# EAGLE design arm_brain_board (EAGLE 6.5.0)

## Sheet 1 of 2
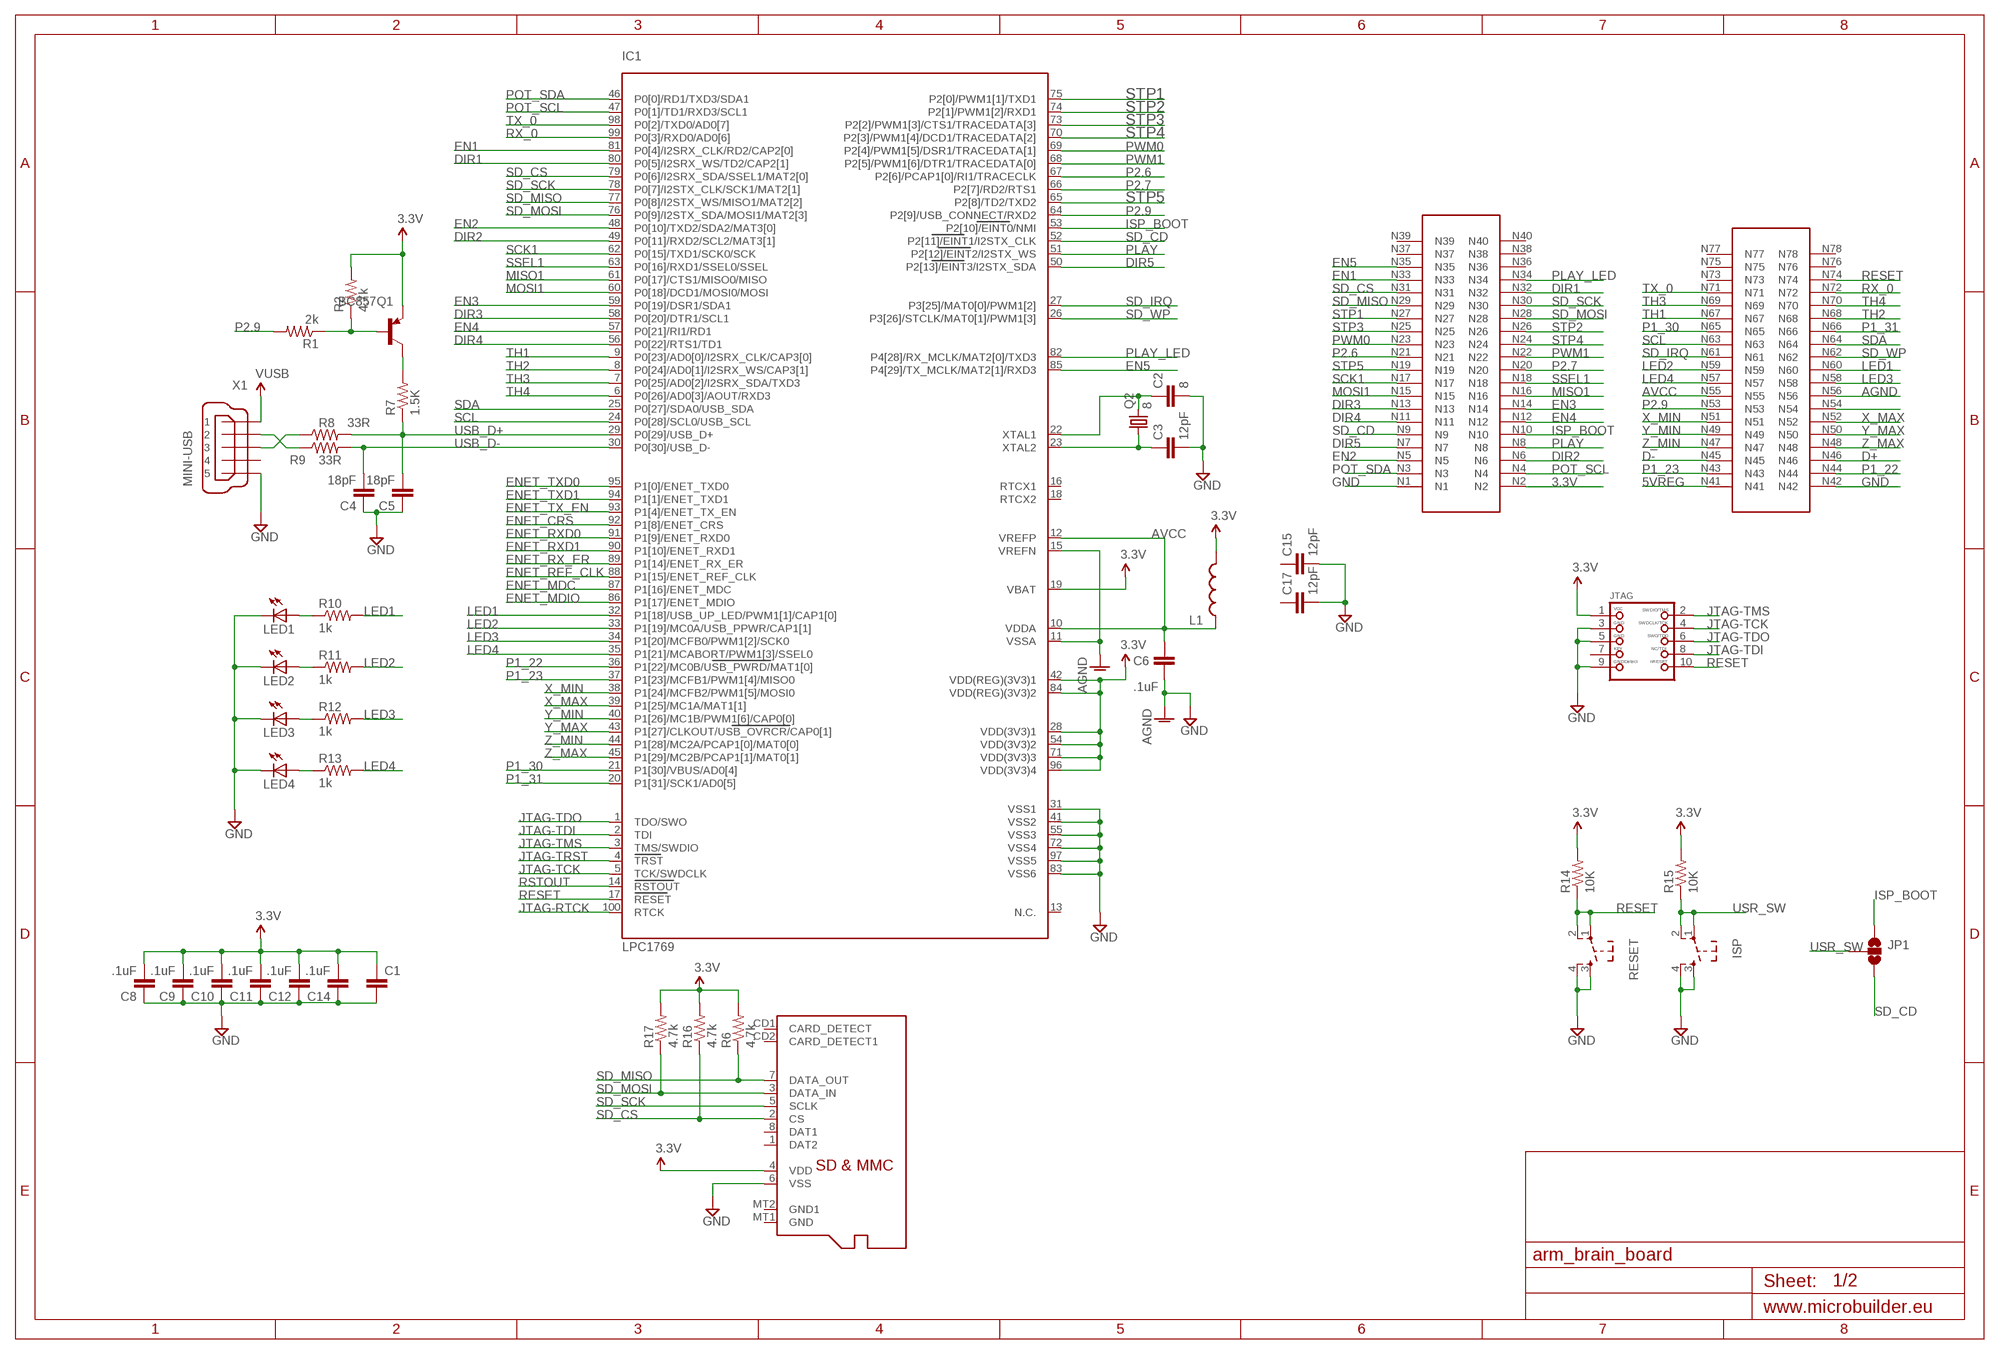
[diagram p0: schematic, sheet 1]

### Parts
C1  CAP0603-CAP  [0603-CAP]
C2  8  CAP0603-CAP  [0603-CAP]
C3  12pF  CAP0603-CAP  [0603-CAP]
C4  18pF  CAP0603-CAP  [0603-CAP]
C5  18pF  C-EUC0603  [C0603]
C6  .1uF  CAP0603-CAP  [0603-CAP]
C8  .1uF  CAP0603-CAP  [0603-CAP]
C9  .1uF  CAP0603-CAP  [0603-CAP]
C10  .1uF  CAP0603-CAP  [0603-CAP]
C11  .1uF  CAP0603-CAP  [0603-CAP]
C12  .1uF  CAP0603-CAP  [0603-CAP]
C14  .1uF  CAP0603-CAP  [0603-CAP]
C15  12pF  CAP0603-CAP  [0603-CAP]
C17  12pF  CAP0603-CAP  [0603-CAP]
IC1  LPC1769  LPC1768  [LQFP100]
ISP  SW_TACT_4P  [SW_TACT_SMALL]
JP1  SOLDERJUMPER_2WAYPASTE2&3  [SJ_3_PASTE2&3]
JTAG  JTAG-CORTEXM3  [2X05_1.27MM_SMT]
L1  INDUCTOR0603  [0603]
LED1  LEDCHIP-LED0603  [CHIP-LED0603]
LED2  LEDCHIP-LED0603  [CHIP-LED0603]
LED3  LEDCHIP-LED0603  [CHIP-LED0603]
LED4  LEDCHIP-LED0603  [CHIP-LED0603]
MICROSD  MICROSD  [MICROSD]
Q1  BC857  BC857BALT1SMD  [SOT23-BEC]
Q2  8  CRYSTALHC49S  [HC49/S]
R1  2k  RESISTOR0603-RES  [0603-RES]
R2  4.7k  RESISTOR0603-RES  [0603-RES]
R6  4.7k  RESISTOR0805-RES  [0805]
R7  1.5K  RESISTOR0603-RES  [0603-RES]
R8  33R  RESISTOR0805-RES  [0805]
R9  33R  RESISTOR0805-RES  [0805]
R10  1k  RESISTOR0603-RES  [0603-RES]
R11  1k  RESISTOR0603-RES  [0603-RES]
R12  1k  RESISTOR0603-RES  [0603-RES]
R13  1k  RESISTOR0603-RES  [0603-RES]
R14  10K  RESISTOR0603-RES  [0603-RES]
R15  10K  RESISTOR0603-RES  [0603-RES]
R16  4.7k  RESISTOR0805-RES  [0805]
R17  4.7k  RESISTOR0805-RES  [0805]
RESET  SW_TACT_4P  [SW_TACT_SMALL]
U$1  CPU_HEADER  [CPU_BOARD]
X1  MINI-USB  MINI-USB_SHIELD5P4-32005-400  [32005-400]

### Nets
3.3V: C1.1 C8.2 C9.2 C10.2 C11.2 C12.2 C14.2 IC1.19(VBAT) IC1.28(VDD(3V3)1) IC1.42(VDD(REG)(3V3)1) IC1.54(VDD(3V3)2) IC1.71(VDD(3V3)3) IC1.84(VDD(REG)(3V3)2) IC1.96(VDD(3V3)4) JTAG.1 L1.2 MICROSD.4(VDD) Q1.E R2.2 R6.2 R14.2 R15.2 R16.2 R17.2 U$1.N2 ; also sheet 2
5VREG: U$1.N41 ; also sheet 2
AGND: C6.2 IC1.11(VSSA) IC1.15(VREFN) U$1.N56 ; supply symbol labelled GND
AVCC: C6.1 IC1.10(VDDA) IC1.12(VREFP) L1.1 U$1.N55
D+: R8.1 U$1.N46 X1.3
D-: R9.1 U$1.N45 X1.2
DIR1: IC1.80(P0[5]/I2SRX_WS/TD2/CAP2[1]) U$1.N32
DIR2: IC1.49(P0[11]/RXD2/SCL2/MAT3[1]) U$1.N6
DIR3: IC1.58(P0[20]/DTR1/SCL1) U$1.N13
DIR4: IC1.56(P0[22]/RTS1/TD1) U$1.N11
DIR5: IC1.50(P2[13]/EINT3/I2STX_SDA) U$1.N7
EN1: IC1.81(P0[4]/I2SRX_CLK/RD2/CAP2[0]) U$1.N33
EN2: IC1.48(P0[10]/TXD2/SDA2/MAT3[0]) U$1.N5
EN3: IC1.59(P0[19]/DSR1/SDA1) U$1.N14
EN4: IC1.57(P0[21]/RI1/RD1) U$1.N12
EN5: IC1.85(P4[29]/TX_MCLK/MAT2[1]/RXD3) U$1.N35
ENET_CRS: IC1.92(P1[8]/ENET_CRS) ; also sheet 2
ENET_MDC: IC1.87(P1[16]/ENET_MDC) ; also sheet 2
ENET_MDIO: IC1.86(P1[17]/ENET_MDIO) ; also sheet 2
ENET_REF_CLK: IC1.88(P1[15]/ENET_REF_CLK) ; also sheet 2
ENET_RX_ER: IC1.89(P1[14]/ENET_RX_ER) ; also sheet 2
ENET_RXD0: IC1.91(P1[9]/ENET_RXD0) ; also sheet 2
ENET_RXD1: IC1.90(P1[10]/ENET_RXD1) ; also sheet 2
ENET_TX_EN: IC1.93(P1[4]/ENET_TX_EN) ; also sheet 2
ENET_TXD0: IC1.95(P1[0]/ENET_TXD0) ; also sheet 2
ENET_TXD1: IC1.94(P1[1]/ENET_TXD1) ; also sheet 2
GND: C1.2 C2.2 C3.2 C4.1 C5.1 C8.1 C9.1 C10.1 C11.1 C12.1 C14.1 C15.2 C17.2 IC1.31(VSS1) IC1.41(VSS2) IC1.55(VSS3) IC1.72(VSS4) IC1.83(VSS6) IC1.97(VSS5) ISP.3 ISP.4 JTAG.3 JTAG.5 JTAG.9 LED1.C LED2.C LED3.C LED4.C MICROSD.6(VSS) RESET.3 RESET.4 U$1.N1 U$1.N42 X1.5 ; also sheet 2
ISP_BOOT: IC1.53(P2[10]/EINT0/NMI) JP1.1 U$1.N10
JTAG-RTCK: IC1.100(RTCK)
JTAG-TCK: IC1.5(TCK/SWDCLK) JTAG.4
JTAG-TDI: IC1.2(TDI) JTAG.8
JTAG-TDO: IC1.1(TDO/SWO) JTAG.6
JTAG-TMS: IC1.3(TMS/SWDIO) JTAG.2
JTAG-TRST: IC1.4(TRST)
LED1: IC1.32(P1[18]/USB_UP_LED/PWM1[1]/CAP1[0]) R10.2 U$1.N60
LED2: IC1.33(P1[19]/MC0A/USB_PPWR/CAP1[1]) R11.2 U$1.N59
LED3: IC1.34(P1[20]/MCFB0/PWM1[2]/SCK0) R12.2 U$1.N58
LED4: IC1.35(P1[21]/MCABORT/PWM1[3]/SSEL0) R13.2 U$1.N57
MISO1: IC1.61(P0[17]/CTS1/MISO0/MISO) U$1.N16
MOSI1: IC1.60(P0[18]/DCD1/MOSI0/MOSI) U$1.N15
N$1: C2.1 IC1.22(XTAL1) Q2.2
N$2: C3.1 IC1.23(XTAL2) Q2.1
N$3: Q1.B R1.1 R2.1
N$12: U$1.N54
N$51: Q1.C R7.2
N$84: LED4.A R13.1
N$85: LED3.A R12.1
N$86: LED2.A R11.1
N$87: LED1.A R10.1
P1_22: IC1.36(P1[22]/MC0B/USB_PWRD/MAT1[0]) U$1.N44
P1_23: IC1.37(P1[23]/MCFB1/PWM1[4]/MISO0) U$1.N43
P1_30: IC1.21(P1[30]/VBUS/AD0[4]) U$1.N65
P1_31: IC1.20(P1[31]/SCK1/AD0[5]) U$1.N66
P2.6: IC1.67(P2[6]/PCAP1[0]/RI1/TRACECLK) U$1.N21
P2.7: IC1.66(P2[7]/RD2/RTS1) U$1.N20
P2.9: IC1.64(P2[9]/USB_CONNECT/RXD2) R1.2 U$1.N53
PLAY: IC1.51(P2[12]/EINT2/I2STX_WS) U$1.N8
PLAY_LED: IC1.82(P4[28]/RX_MCLK/MAT2[0]/TXD3) U$1.N34
POT_SCL: IC1.47(P0[1]/TD1/RXD3/SCL1) U$1.N4
POT_SDA: IC1.46(P0[0]/RD1/TXD3/SDA1) U$1.N3
PWM0: IC1.69(P2[4]/PWM1[5]/DSR1/TRACEDATA[1]) U$1.N23
PWM1: IC1.68(P2[5]/PWM1[6]/DTR1/TRACEDATA[0]) U$1.N22
RESET: IC1.17(RESET) JTAG.10 R14.1 RESET.1 RESET.2 U$1.N74
RSTOUT: IC1.14(RSTOUT) ; also sheet 2
RX_0: IC1.99(P0[3]/RXD0/AD0[6]) U$1.N72
SCK1: IC1.62(P0[15]/TXD1/SCK0/SCK) U$1.N17
SCL: IC1.24(P0[28]/SCL0/USB_SCL) U$1.N63
SD_CD: IC1.52(P2[11]/EINT1/I2STX_CLK) JP1.3 U$1.N9
SD_CS: IC1.79(P0[6]/I2SRX_SDA/SSEL1/MAT2[0]) MICROSD.2(CS) R16.1 U$1.N31
SD_IRQ: IC1.27(P3[25]/MAT0[0]/PWM1[2]) U$1.N61
SD_MISO: IC1.77(P0[8]/I2STX_WS/MISO1/MAT2[2]) MICROSD.7(DATA_OUT) R6.1 U$1.N29
SD_MOSI: IC1.76(P0[9]/I2STX_SDA/MOSI1/MAT2[3]) MICROSD.3(DATA_IN) R17.1 U$1.N28
SD_SCK: IC1.78(P0[7]/I2STX_CLK/SCK1/MAT2[1]) MICROSD.5(SCLK) U$1.N30
SD_WP: IC1.26(P3[26]/STCLK/MAT0[1]/PWM1[3]) U$1.N62
SDA: IC1.25(P0[27]/SDA0/USB_SDA) U$1.N64
SSEL1: IC1.63(P0[16]/RXD1/SSEL0/SSEL) U$1.N18
STP1: IC1.75(P2[0]/PWM1[1]/TXD1) U$1.N27
STP2: IC1.74(P2[1]/PWM1[2]/RXD1) U$1.N26
STP3: IC1.73(P2[2]/PWM1[3]/CTS1/TRACEDATA[3]) U$1.N25
STP4: IC1.70(P2[3]/PWM1[4]/DCD1/TRACEDATA[2]) U$1.N24
STP5: IC1.65(P2[8]/TD2/TXD2) U$1.N19
TH1: IC1.9(P0[23]/AD0[0]/I2SRX_CLK/CAP3[0]) U$1.N67
TH2: IC1.8(P0[24]/AD0[1]/I2SRX_WS/CAP3[1]) U$1.N68
TH3: IC1.7(P0[25]/AD0[2]/I2SRX_SDA/TXD3) U$1.N69
TH4: IC1.6(P0[26]/AD0[3]/AOUT/RXD3) U$1.N70
TX_0: IC1.98(P0[2]/TXD0/AD0[7]) U$1.N71
USB_D+: C5.2 IC1.29(P0[29]/USB_D+) R7.1 R8.2
USB_D-: C4.2 IC1.30(P0[30]/USB_D-) R9.2
USR_SW: ISP.1 ISP.2 JP1.2 R15.1
VUSB: X1.1 ; also sheet 2
X_MAX: IC1.39(P1[25]/MC1A/MAT1[1]) U$1.N52
X_MIN: IC1.38(P1[24]/MCFB2/PWM1[5]/MOSI0) U$1.N51
Y_MAX: IC1.43(P1[27]/CLKOUT/USB_OVRCR/CAP0[1]) U$1.N50
Y_MIN: IC1.40(P1[26]/MC1B/PWM1[6]/CAP0[0]) U$1.N49
Z_MAX: IC1.45(P1[29]/MC2B/PCAP1[1]/MAT0[1]) U$1.N48
Z_MIN: IC1.44(P1[28]/MC2A/PCAP1[0]/MAT0[0]) U$1.N47
Unconnected: C15.1 C17.1 IC1.13(N.C.) IC1.16(RTCX1) IC1.18(RTCX2) JTAG.7 MICROSD.1(DAT2) MICROSD.8(DAT1) MICROSD.CD1(CARD_DETECT) MICROSD.CD2(CARD_DETECT1) MICROSD.MT1(GND) MICROSD.MT2(GND1) U$1.N36 U$1.N37 U$1.N38 U$1.N39 U$1.N40 U$1.N73 U$1.N75 U$1.N76 U$1.N77 U$1.N78 X1.4 X1.M1(S1) X1.M2(S2) X1.M3(S3) X1.M4(S4)

## Sheet 2 of 2
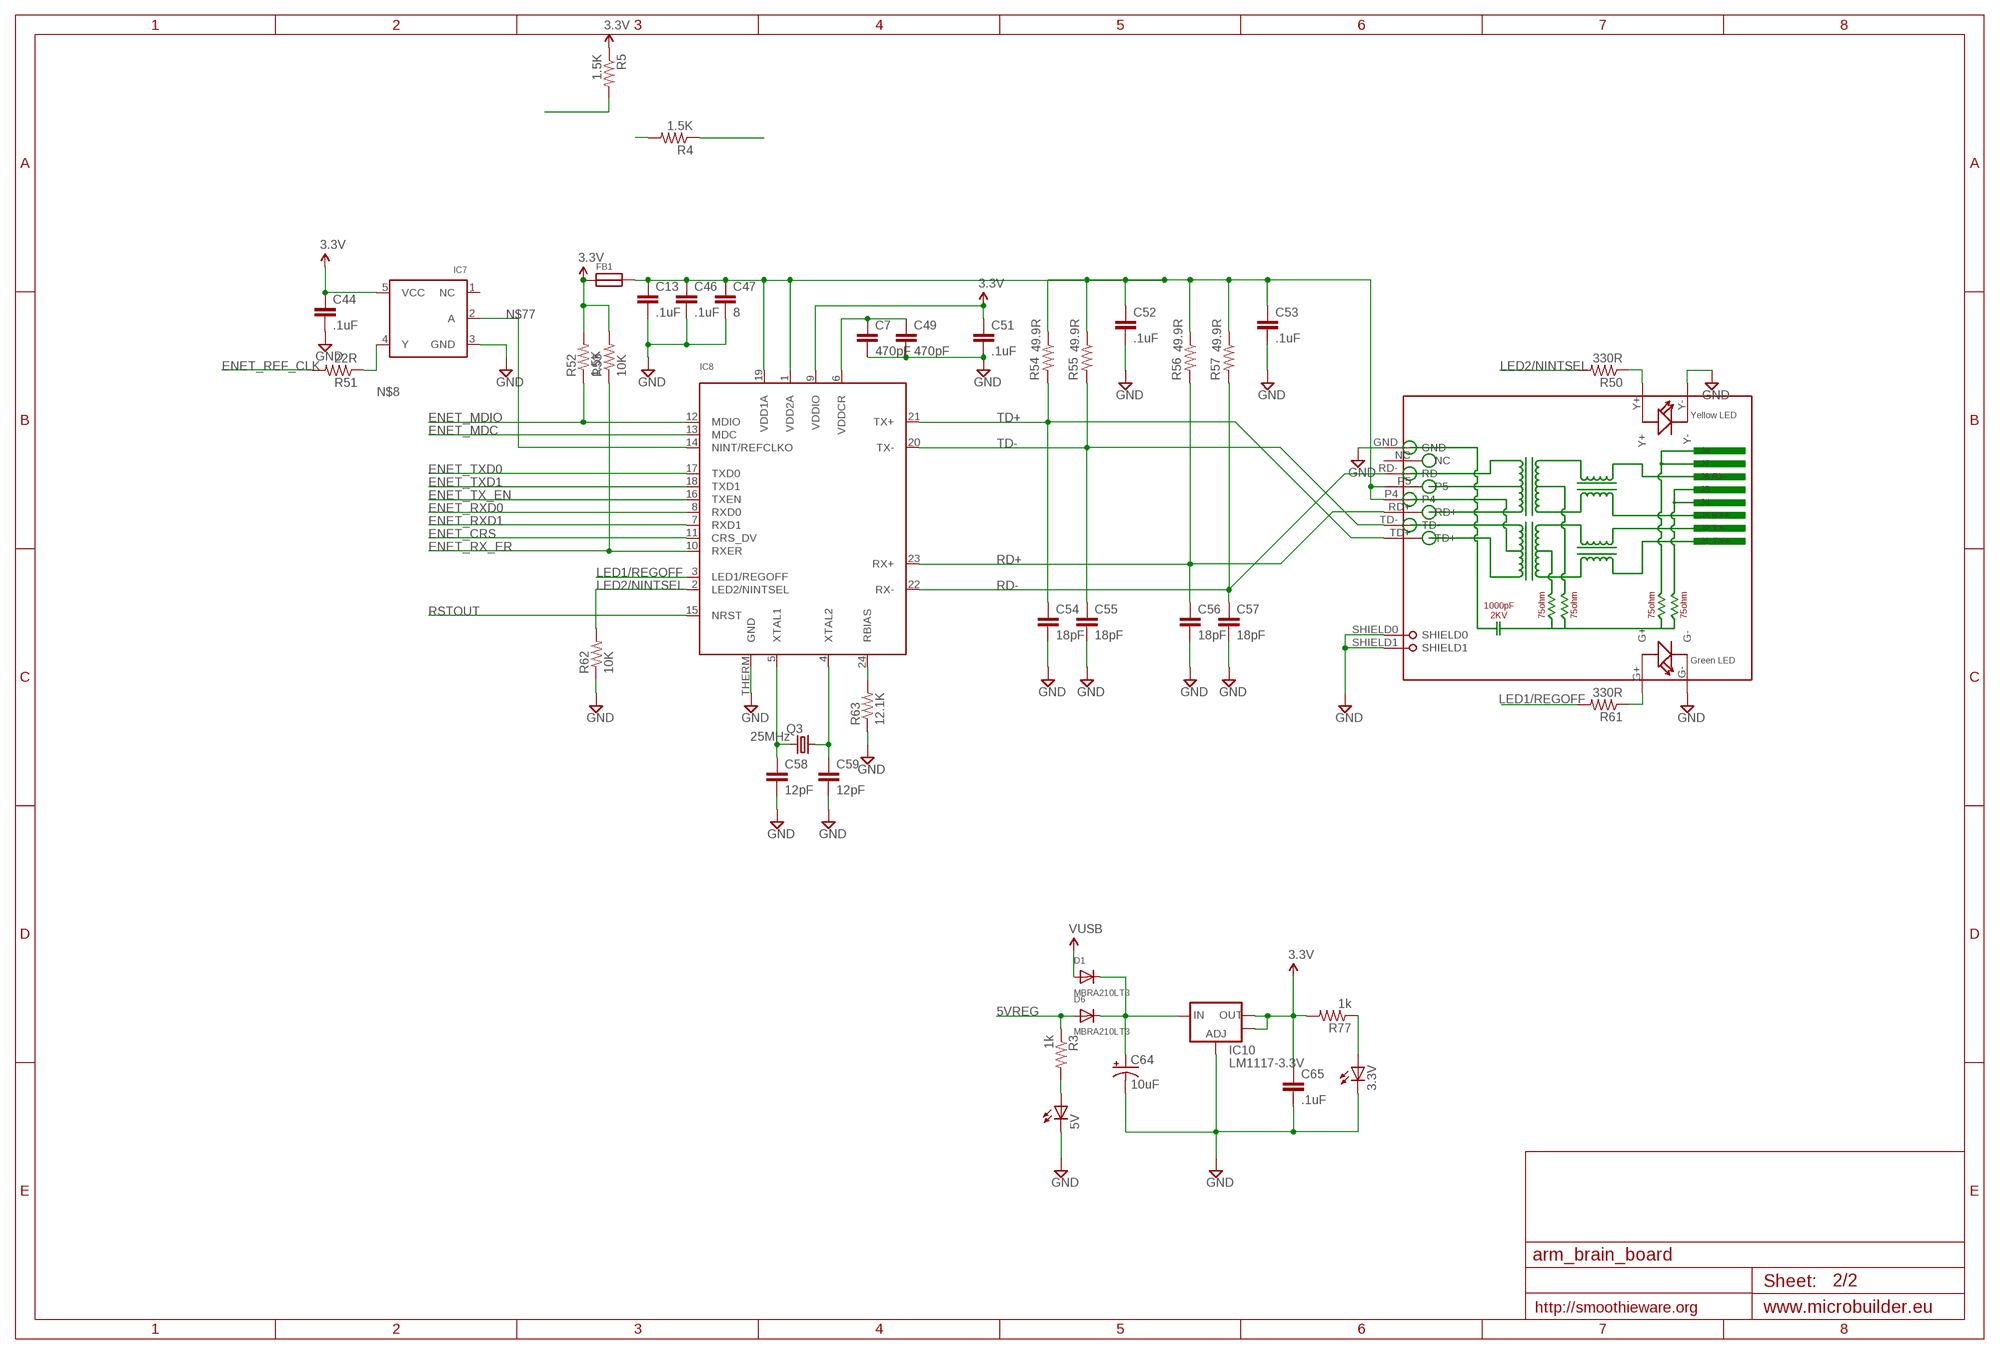
[diagram p1: schematic, sheet 2]

### Parts
3.3V  LEDCHIP-LED0603  [CHIP-LED0603]
5V  LEDCHIP-LED0603  [CHIP-LED0603]
C7  470pF  CAP0603-CAP  [0603-CAP]
C13  .1uF  CAP0603-CAP  [0603-CAP]
C44  .1uF  CAP0603-CAP  [0603-CAP]
C46  .1uF  CAP0603-CAP  [0603-CAP]
C47  8  CAP0603-CAP  [0603-CAP]
C49  470pF  CAP0603-CAP  [0603-CAP]
C51  .1uF  CAP0603-CAP  [0603-CAP]
C52  .1uF  CAP0603-CAP  [0603-CAP]
C53  .1uF  CAP0603-CAP  [0603-CAP]
C54  18pF  CAP0805  [0805]
C55  18pF  CAP0603-CAP  [0603-CAP]
C56  18pF  CAP0603-CAP  [0603-CAP]
C57  18pF  CAP0805  [0805]
C58  12pF  CAP0603-CAP  [0603-CAP]
C59  12pF  CAP0603-CAP  [0603-CAP]
C64  10uF  CAP_POL1206  [EIA3216]
C65  .1uF  CAP0805  [0805]
D1  MBRA210LT3  DIODESOD-123  [SOD-123]
D6  MBRA210LT3  DIODESOD-123  [SOD-123]
FB1  FERRITE  [0603]
IC7  74LVC1G04  [SOT23-5]
IC8  LAN8720  [QFN24_4MM]
IC10  LM1117-3.3V  V_REG_LM1117SOT223  [SOT223]
Q3  25MHz  CRYSTALHC49S  [HC49/S]
R3  1k  RESISTOR0603-RES  [0603-RES]
R4  1.5K  RESISTOR0603-RES  [0603-RES]
R5  1.5K  RESISTOR0603-RES  [0603-RES]
R50  330R  R-US_R0603  [R0603]
R51  22R  RESISTOR0603-RES  [0603-RES]
R52  1.5K  RESISTOR0603-RES  [0603-RES]
R53  10K  RESISTOR0603-RES  [0603-RES]
R54  49.9R  RESISTOR0603-RES  [0603-RES]
R55  49.9R  RESISTOR0805-RES  [0805]
R56  49.9R  RESISTOR0805-RES  [0805]
R57  49.9R  RESISTOR0603-RES  [0603-RES]
R61  330R  R-US_R0603  [R0603]
R62  10K  RESISTOR0603-RES  [0603-RES]
R63  12.1K  RESISTOR0603-RES  [0603-RES]
R77  1k  RESISTOR0603-RES  [0603-RES]
RJ1  HR911105A  [HR911105A]

### Nets
3.3V: C44.1 C51.1 C65.1 FB1.1 IC7.5(VCC) IC8.9(VDDIO) IC10.2(OUT) IC10.4(OUT) R5.1 R52.2 R53.2 R77.2 ; also sheet 1
5VREG: D6.A R3.1 ; also sheet 1
ENET_CRS: IC8.11(CRS_DV) ; also sheet 1
ENET_MDC: IC8.13(MDC) ; also sheet 1
ENET_MDIO: IC8.12(MDIO) R52.1 ; also sheet 1
ENET_REF_CLK: R51.2 ; also sheet 1
ENET_RX_ER: IC8.10(RXER) R53.1 ; also sheet 1
ENET_RXD0: IC8.8(RXD0) ; also sheet 1
ENET_RXD1: IC8.7(RXD1) ; also sheet 1
ENET_TX_EN: IC8.16(TXEN) ; also sheet 1
ENET_TXD0: IC8.17(TXD0) ; also sheet 1
ENET_TXD1: IC8.18(TXD1) ; also sheet 1
GND: 3.3V.C 5V.C C7.2 C13.2 C44.2 C46.2 C47.2 C49.2 C51.2 C52.2 C53.2 C54.2 C55.2 C56.2 C57.2 C58.2 C59.2 C64.C(-) C65.2 IC7.3(GND) IC8.THERM(GND) IC10.1(ADJ) R62.1 R63.1 RJ1.G- RJ1.GND RJ1.SHIELD0 RJ1.SHIELD1 RJ1.Y- ; also sheet 1
LED1/REGOFF: IC8.3(LED1/REGOFF) R61.2
LED2/NINTSEL: IC8.2(LED2/NINTSEL) R50.2 R62.2
N$4: C64.A(+) D1.C D6.C IC10.3(IN)
N$5: R50.1 RJ1.Y+
N$6: R61.1 RJ1.G+
N$8: IC7.4(Y) R5.2 R51.1
N$9: R4.2
N$10: 5V.A R3.2
N$16: C13.1 C46.1 C47.1 C52.1 C53.1 FB1.2 IC8.1(VDD2A) IC8.19(VDD1A) R54.1 R55.1 R56.1 R57.1 RJ1.P4 RJ1.P5
N$67: C59.1 IC8.4(XTAL2) Q3.1
N$68: C58.1 IC8.5(XTAL1) Q3.2
N$69: IC8.24(RBIAS) R63.2
N$77: IC7.2(A) IC8.14(NINT/REFCLKO) R4.1
N$80: 3.3V.A R77.1
N$82: C7.1 C49.1 IC8.6(VDDCR)
RD+: C56.1 IC8.23(RX+) R56.2 RJ1.RD+
RD-: C57.1 IC8.22(RX-) R57.2 RJ1.RD-
RSTOUT: IC8.15(NRST) ; also sheet 1
TD+: C54.1 IC8.21(TX+) R54.2 RJ1.TD+
TD-: C55.1 IC8.20(TX-) R55.2 RJ1.TD-
VUSB: D1.A ; also sheet 1
Unconnected: IC7.1(NC) RJ1.NC

### Notes on the sheet
- http://smoothieware.org

## Library data of the parts
3.3V 5V LED1-LED4 = adafruit:LED: LED OSRAM: - CHIPLED LG R971, LG N971, LY N971, LG Q971, LY Q971, LO R971, LY R971 LH N974, LH R974 LS Q976, LO Q976, LY Q976 LO Q996 - Hyper CHIPLED LW Q18S LB Q993, LB Q99A, LB R99A - SideLED LS A670, LO A670, LY A670, LG A670, LP A670 LB A673, LV A673, LT A673, LW A673 LH A674 LY A675 LS A676, LA A676, LO A676, LY A676, LW A676 LS A679, LY A679, LG A679 - Hyper Micro SIDELED® LS Y876, LA Y876, LO Y876, LY Y876 LT Y87S - SmartLED LW L88C, LW L88S LB L89C, LB L89S, LG L890 LS L89K, LO L89K, LY L89K LS L896, LA L896, LO L896, LY L896 - TOPLED LS T670, LO T670, LY T670, LG T670, LP T670 LSG T670, LSP T670, LSY T670, LOP T670, LYG T670 LG T671, LOG T671, LSG T671 LB T673, LV T673, LT T673, LW T673 LH T674 LS T676, LA T676, LO T676, LY T676, LB T676, LH T676, LSB T676, LW T676 LB T67C, LV T67C, LT T67C, LS T67K, LO T67K, LY T67K, LW E67C LS E67B, LA E67B, LO E67B, LY E67B, LB E67C, LV E67C, LT E67C LW T67C LS T679, LY T679, LG T679 LS T770, LO T770, LY T770, LG T770, LP T770 LB T773, LV T773, LT T773, LW T773 LH T774 LS E675, LA E675, LY E675, LS T675 LS T776, LA T776, LO T776, LY T776, LB T776 LHGB T686 LT T68C, LB T68C - Hyper Mini TOPLED® LB M676 - Mini TOPLED Santana® LG M470 LS M47K, LO M47K, LY M47K Source: http://www.osram.convergy.de/
C1-C4 C6-C15 C17 C44 C46 C47 C49 C51-C59 C65 = SparkFun:CAP: Capacitor Standard 0603 ceramic capacitor, and 0.1" leaded capacitor.
C5 = rcl:C-EU: CAPACITOR, European symbol
C64 = SparkFun:CAP_POL: Capacitor Polarized These are standard SMD and PTH capacitors. Normally 10uF, 47uF, and 100uF in electrolytic and tantalum varieties. Always verify the external diameter of the through hole cap, it varies with capacity, voltage, and manufacturer. The EIA devices should be standard.
D1 D6 = adafruit:DIODE: Diode SMADIODE - SMA Surface Mount Package 20V 1A Schottky Diode Digikey: 641-1014-6-ND DO-1N4148 - Through Hole Small Current Diode SOD-123 20V 1 A (.5mV Vf) Schottky Diode - Digikey: MBRX120TPMSCT-ND SOD-323 10V 570mA (.38mV Vf, 3ns) Schottky Diode - Digikey: ZLLS410CT-ND SOD-523 30V 30mA Schottky Diode (RB751S-40TE61) - Digikey: RB751S-40TE61CT-ND SOT23-R/W - SOT23 Package (R = Solder Paste/Reflow Ovens, W = Hand-Soldering) BAT54Film 40V 300mA - Digikey: 497-7162-1-ND
FB1 = microbuilder:FERRITE: Ferrite Bead 0603 MMZ1608B121C - 120 Ohm, 600mA Ferrite Chip - Digikey: 445-2164-1-ND BK1608HW121-T - 120 Ohm, 600mA Ferrite Chip - Digikey: 587-1876-2-ND
IC1 = microbuilder:LPC1768: LPC1768 100 MHz 32-bit ARM Cortex-M3 based microcontroller featuring a high level of integration and low power consumption. 512 kB Flash, 64 kB SRAM, USB Device/Host/OTG, Ethernet, CAN, I2S, 10-bit DAC Digikey: 568-4796-ND
IC7 = microbuilder:74LVC1G04: 74LVC1G04 - Single Inverter Gate SOT23-5 SN74LVC1G04DBVR - Digikey: 296-11599-1-ND
IC8 = microbuilder:LAN8720: LAN8720A 10/100 Ethernet PHY Mouser: 886-LAN8720AI-CP
IC10 = SparkFun:V_REG_LM1117: Voltage Regulator LM1117 Standard adjustable voltage regulator but in SMD form. Spark Fun Electronics SKU : COM-00595
ISP RESET = dp_devices:SW_TACT_4P
JP1 = SparkFun:SOLDERJUMPER_2WAY: Solder Jumper 2 way solder jumper
JTAG = microbuilder:JTAG-CORTEXM3: Serial Wire (SW-DP) Connector This standard 0.05" 10-pin connector is for use with the Cortex M0/M3's native SWD (serial wire debugger) interface (SW-DP). Some boards support a 20-pin combined JTAG+SWD connector (SWJ-DP), such as the LPC1700 family, but many smaller devices only work with SWD which typically use the smaller 10-pin SW-DP connecter (the LPC1300 family, for example, only supports SWD). 2x05 1.27mm/0.05" Connector: This is the standard SMT connector defined by ARM for all Cortex devices, and should be used in most situations and for forward-compatibility since any new devices coming to market will likely use this connector. MOLEX 10 Pin 0.1" Connector: This 0.1" 10 pin connector has the same pin layout as the standard 0.05" connector, but is easier to work with if you are using standard jumper wires or custom cables to connect your SWD hardware. MOLEX 20 Pin 0.1" Connector: This 0.1" 20 pin connector is the same model used for ARM7/ARM9 JTAG debuggers, but is connected to match the pins on the Segger J-Link for ARM (which supports both JTAG and SWD debugging). See the following document from ARM for more information on Cortex M3 Debug Connectors: http://infocenter.arm.com/help/topic/com.arm.doc.faqs/attached/13634/cortex_debug_connectors.pdf And the following page for an overview with images of the different connector types: http://www.keil.com/peripherals/coresight/connectors.asp
L1 = SparkFun:INDUCTOR: Inductors Basic Inductor/Choke - 0603 and 1206. Footprints are not proven and vary greatly between part numbers.
MICROSD = adafruit:MICROSD: Micro-SD / Transflash card holder with SPI pinout For the 3M # 2908-05WB-MG and/or 4UCON #19656 push-push type
Q1 = transistor-pnp:BC857*: PNP Transistror
Q2 Q3 = adafruit:CRYSTAL: CRYSTAL; OC_FARNELL: 1667008; OC_NEWARK: unknown
R1-R17 R51-R57 R62 R63 R77 = SparkFun:RESISTOR: Resistor Basic schematic elements and footprints for 0603, 1206, and PTH resistors.
R50 R61 = resistor:R-US_: RESISTOR, American symbol
RJ1 = Itead_BP_110825.lbr:HR911105A: SOC006
U$1 = custom_parts:CPU_HEADER
X1 = con-cypressindustries:MINI-USB_SHIELD5P4-: MINI USB-B R/A W/O POST 5 pol. Source: www.cypressindustries.com; OC_FARNELL: unknown; OC_NEWARK: unknown

## Board
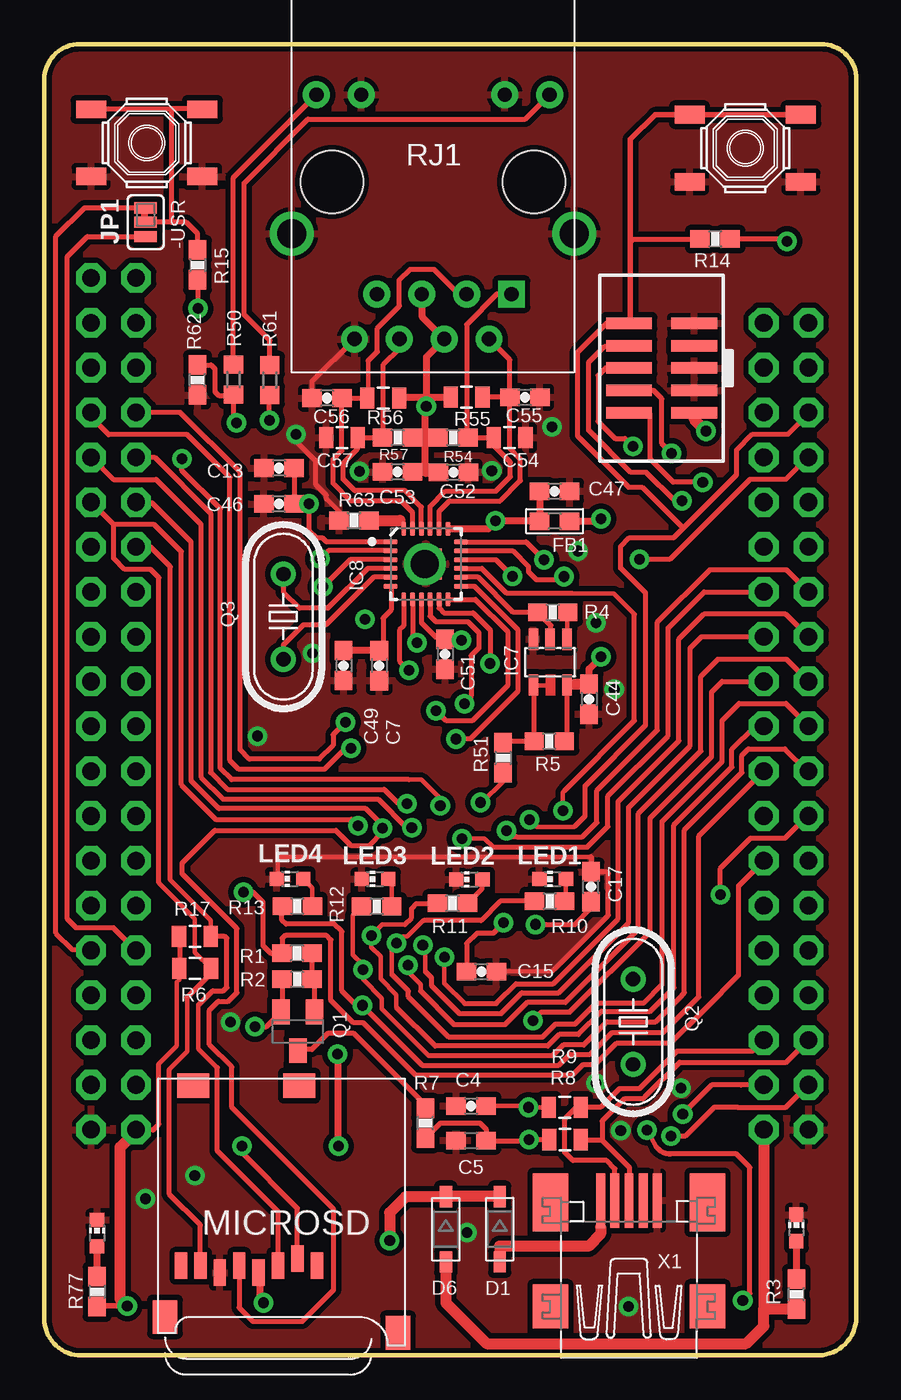
[diagram p2: board, top side]
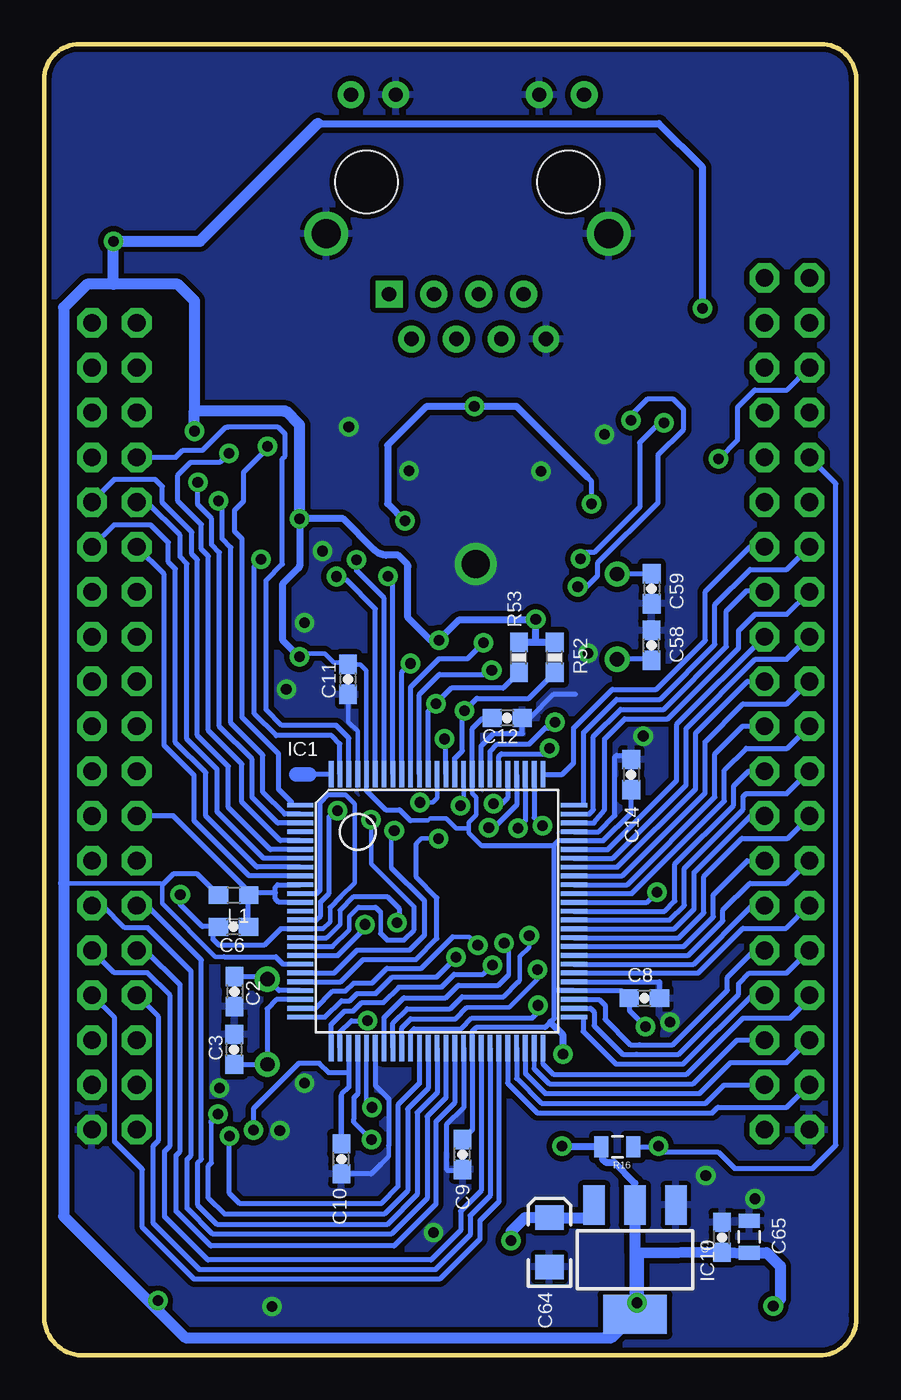
[diagram p3: board, bottom side, seen from below]

Size 46.01 x 74.3 mm. Coordinates in mm from the lower left corner, seen from the top.
Outline: 43.91,0 arc90 46.01,2.3 46.01,72.3 arc90 44.01,74.3 2.01,74.3 arc90 0.01,72.3 0.01,2.3 arc90 1.91,0 43.91,0
Copper layers (1*16): Top 0.035mm / dielectric 1.5mm / Bottom 0.035mm
Design rules "SparkFun": minimum track width 8mil, minimum drill 20mil, track to track 8mil, track to pad 8mil, pad to pad 8mil, via to via 8mil, smd to smd 8mil, copper to edge 10mil, drill to drill 8mil, minimum pad ring 12mil, minimum via ring 10mil, stop-mask expansion 4mil, vias tented up to drill 25mil, thermal gap 10mil

### Footprints (pad centres in the part's own frame; a part is rotated, then mirrored left to right if it is on the bottom)
CHIP-LED0603 = smd 0.8 x 0.8: A 0,-0.75; C 0,0.75
0603-CAP = smd 1.1 x 1: 1 -0.85,0; 2 0.85,0
C0603 = smd 1.1 x 1: 1 -0.85,0; 2 0.85,0
0805 = smd 0.8 x 1.2: 1 -0.9,0; 2 0.9,0
EIA3216 = smd 1.4 x 1.6: A 1.4,0; C -1.4,0
SOD-123 = smd 1.2 x 0.7: A 1.85,0; C -1.85,0
0603 = smd 1.1 x 1: 1 -0.85,0; 2 0.85,0
LQFP100 = smd 0.27 x 1.5: 1 -6,-7.75; 2 -5.5,-7.75; 3 -5,-7.75; 4 -4.5,-7.75; 5 -4,-7.75; 6 -3.5,-7.75; 7 -3,-7.75; 8 -2.5,-7.75; 9 -2,-7.75; 10 -1.5,-7.75; 11 -1,-7.75; 12 -0.5,-7.75; 13 0,-7.75; 14 0.5,-7.75; 15 1,-7.75; 16 1.5,-7.75; 17 2,-7.75; 18 2.5,-7.75; 19 3,-7.75; 20 3.5,-7.75; 21 4,-7.75; 22 4.5,-7.75; 23 5,-7.75; 24 5.5,-7.75; 25 6,-7.75; 51 6,7.75; 52 5.5,7.75; 53 5,7.75; 54 4.5,7.75; 55 4,7.75; 56 3.5,7.75; 57 3,7.75; 58 2.5,7.75; 59 2,7.75; 60 1.5,7.75; 61 1,7.75; 62 0.5,7.75; 63 0,7.75; 64 -0.5,7.75; 65 -1,7.75; 66 -1.5,7.75; 67 -2,7.75; 68 -2.5,7.75; 69 -3,7.75; 70 -3.5,7.75; 71 -4,7.75; 72 -4.5,7.75; 73 -5,7.75; 74 -5.5,7.75; 75 -6,7.75 | smd 1.5 x 0.27: 26 7.75,-6; 27 7.75,-5.5; 28 7.75,-5; 29 7.75,-4.5; 30 7.75,-4; 31 7.75,-3.5; 32 7.75,-3; 33 7.75,-2.5; 34 7.75,-2; 35 7.75,-1.5; 36 7.75,-1; 37 7.75,-0.5; 38 7.75,0; 39 7.75,0.5; 40 7.75,1; 41 7.75,1.5; 42 7.75,2; 43 7.75,2.5; 44 7.75,3; 45 7.75,3.5; 46 7.75,4; 47 7.75,4.5; 48 7.75,5; 49 7.75,5.5; 50 7.75,6; 76 -7.75,6; 77 -7.75,5.5; 78 -7.75,5; 79 -7.75,4.5; 80 -7.75,4; 81 -7.75,3.5; 82 -7.75,3; 83 -7.75,2.5; 84 -7.75,2; 85 -7.75,1.5; 86 -7.75,1; 87 -7.75,0.5; 88 -7.75,0; 89 -7.75,-0.5; 90 -7.75,-1; 91 -7.75,-1.5; 92 -7.75,-2; 93 -7.75,-2.5; 94 -7.75,-3; 95 -7.75,-3.5; 96 -7.75,-4; 97 -7.75,-4.5; 98 -7.75,-5; 99 -7.75,-5.5; 100 -7.75,-6
SOT23-5 = smd 0.55 x 1.2: 1 -0.95,-1.3; 2 0,-1.3; 3 0.95,-1.3; 4 0.95,1.3; 5 -0.95,1.3
QFN24_4MM = smd 0.8 x 0.28: 1 -2,1.25; 2 -2,0.75; 3 -2,0.25; 4 -2,-0.25; 5 -2,-0.75; 6 -2,-1.25; 13 2,-1.25; 14 2,-0.75; 15 2,-0.25; 16 2,0.25; 17 2,0.75; 18 2,1.25 | smd 0.28 x 0.8: 7 -1.25,-2; 8 -0.75,-2; 9 -0.25,-2; 10 0.25,-2; 11 0.75,-2; 12 1.25,-2; 19 1.25,2; 20 0.75,2; 21 0.25,2; 22 -0.25,2; 23 -0.75,2; 24 -1.25,2 | smd 1.778 x 1.778: THERM 0,0
SOT223 = smd 1.219 x 2.235: 1 -2.311,-3.099; 2 0,-3.099; 3 2.311,-3.099 | smd 3.6 x 2.2: 4 0,3.099
SW_TACT_SMALL = smd 1.7 x 1: 1 -3.15,1.9; 2 3.15,1.9; 3 -3.15,-1.9; 4 3.15,-1.9
SJ_3_PASTE2&3 = smd 0.635 x 1.27: 1 -0.813,0; 2 0,0; 3 0.813,0
2X05_1.27MM_SMT = smd 0.65 x 2.6: 1 -2.54,-1.85; 2 -2.54,1.85; 3 -1.27,-1.85; 4 -1.27,1.85; 5 0,-1.85; 6 0,1.85; 7 1.27,-1.85; 8 1.27,1.85; 9 2.54,-1.85; 10 2.54,1.85
MICROSD = smd 0.7 x 1.5: 1 9,-10.64; 2 7.9,-10.24; 3 6.8,-10.64; 4 5.7,-11.04; 5 4.6,-10.64; 6 3.5,-11.04; 7 2.4,-10.64; 8 1.3,-10.64 | smd 1.8 x 1.4: CD1 2,-0.44; CD2 8,-0.44 | smd 1.4 x 1.9: MT1 0.4,-13.54; MT2 13.6,-14.44
SOT23-BEC = smd 1 x 1.4: B -0.95,-1.1; C 0,1.1; E 0.95,-1.1
HC49/S = drill 0.813: 1 -2.413,0; 2 2.413,0
0603-RES = smd 1.1 x 1: 1 -0.85,0; 2 0.85,0
R0603 = smd 1 x 1.1: 1 -0.85,0; 2 0.85,0
HR911105A = drill 0.813 pad 1.524: G+ 4.953,-6.604; G- 4.953,-4.064; GND -8.89,4.445; NC -6.35,3.175; P4 -8.89,-0.635; P5 -6.35,0.635; RD+ -6.35,-1.905; RD- -8.89,1.905; TD- -8.89,-3.175; Y+ 4.953,6.604; Y- 4.953,4.064 | drill 1.651 pad 2.159: SHIELD0 -2.921,8.001; SHIELD1 -2.921,-8.001 | drill 0.813 pad 1.524 square: TD+ -6.35,-4.445 | hole 3.556: 0,-5.715; 0,5.715
CPU_BOARD = drill 1 pad 1.676 octagon: N1 0,0; N2 2.54,0; N3 0,2.54; N4 2.54,2.54; N5 0,5.08; N6 2.54,5.08; N7 0,7.62; N8 2.54,7.62; N9 0,10.16; N10 2.54,10.16; N11 0,12.7; N12 2.54,12.7; N13 0,15.24; N14 2.54,15.24; N15 0,17.78; N16 2.54,17.78; N17 0,20.32; N18 2.54,20.32; N19 0,22.86; N20 2.54,22.86; N21 0,25.4; N22 2.54,25.4; N23 0,27.94; N24 2.54,27.94; N25 0,30.48; N26 2.54,30.48; N27 0,33.02; N28 2.54,33.02; N29 0,35.56; N30 2.54,35.56; N31 0,38.1; N32 2.54,38.1; N33 0,40.64; N34 2.54,40.64; N35 0,43.18; N36 2.54,43.18; N37 0,45.72; N38 2.54,45.72; N39 0,48.26; N40 2.54,48.26; N41 38.1,0; N42 40.64,0; N43 38.1,2.54; N44 40.64,2.54; N45 38.1,5.08; N46 40.64,5.08; N47 38.1,7.62; N48 40.64,7.62; N49 38.1,10.16; N50 40.64,10.16; N51 38.1,12.7; N52 40.64,12.7; N53 38.1,15.24; N54 40.64,15.24; N55 38.1,17.78; N56 40.64,17.78; N57 38.1,20.32; N58 40.64,20.32; N59 38.1,22.86; N60 40.64,22.86; N61 38.1,25.4; N62 40.64,25.4; N63 38.1,27.94; N64 40.64,27.94; N65 38.1,30.48; N66 40.64,30.48; N67 38.1,33.02; N68 40.64,33.02; N69 38.1,35.56; N70 40.64,35.56; N71 38.1,38.1; N72 40.64,38.1; N73 38.1,40.64; N74 40.64,40.64; N75 38.1,43.18; N76 40.64,43.18; N77 38.1,45.72; N78 40.64,45.72
32005-400 = smd 3.1 x 0.5: 1 3,1.6; 2 3,0.8; 3 3,0; 4 3,-0.8; 5 3,-1.6 | smd 2.5 x 2: M1 -3,-4.45; M2 -3,4.45 | smd 3.3 x 2: M3 2.9,4.45; M4 2.9,-4.45

### Placement (x,y rotation side)
3.3V  2.99,6.92 0 top
5V  42.61,7.23 0 top
C1  7.61,6.69 90 bottom
C2  35.22,20.62 270 bottom
C3  35.24,17.34 90 bottom
C4  24.19,14.13 0 top
C5  24.18,12.18 0 top
C6  35.28,24.28 180 bottom
C7  18.98,39.09 270 top
C8  12.02,20.24 180 bottom
C9  22.31,11.38 90 bottom
C10  29.18,11.13 90 bottom
C11  28.79,38.3 90 bottom
C12  19.78,36.12 180 bottom
C13  13.31,50.28 180 top
C14  12.76,32.91 270 bottom
C15  24.76,21.75 0 top
C17  30.98,26.55 90 top
C44  30.87,37.19 270 top
C46  13.3,48.25 180 top
C47  28.91,48.96 0 top
C49  16.97,39.09 270 top
C51  22.71,39.74 270 top
C52  23.18,50.04 0 top
C53  20.02,50.06 180 top
C54  26.37,52 0 top
C55  27.23,54.29 0 top
C56  16.03,54.24 180 top
C57  16.87,52 180 top
C58  11.61,40.23 90 bottom
C59  11.6,43.45 270 bottom
C64  17.39,6.41 90 bottom
C65  6.07,6.72 90 bottom
D1  25.81,7.15 270 top
D6  22.75,7.15 270 top
FB1  28.91,47.27 180 top
IC1  23.75,25.17 270 bottom
IC7  28.66,39.28 180 top
IC8  21.62,44.84 0 top
IC10  12.54,5.42 180 bottom
ISP  5.81,68.7 0 top
JP1  5.75,64.21 90 top
JTAG  34.98,55.94 90 top
L1  35.27,26.07 180 bottom
LED1  28.81,26.99 90 top
LED2  24.08,26.97 90 top
LED3  18.75,26.99 90 top
LED4  13.92,27 90 top
MICROSD  6.45,15.72 0 top
Q1  14.37,18.36 180 top
Q2  33.36,18.9 90 top
Q3  13.55,41.86 270 top
R1  14.32,22.8 180 top
R2  14.33,21.31 180 top
R3  42.61,3.47 90 top
R4  28.81,42.1 0 top
R5  28.61,34.8 180 top
R6  8.55,21.92 180 top
R7  21.6,13.16 90 top
R8  29.5,12.22 180 top
R9  29.49,14.06 180 top
R10  28.63,25.74 180 top
R11  23.13,25.61 180 top
R12  18.84,25.44 180 top
R13  14.34,25.45 180 top
R14  38,63.26 0 top
R15  8.69,61.79 270 top
R16  13.54,11.81 180 bottom
R17  8.54,23.74 180 top
R50  10.72,55.29 270 top
R51  26,33.86 270 top
R52  17.09,39.55 90 bottom
R53  19.12,39.55 90 bottom
R54  23.17,52 0 top
R55  23.93,54.29 0 top
R56  19.21,54.24 180 top
R57  20.02,52 180 top
R61  12.78,55.26 270 top
R62  8.69,55.27 90 top
R63  17.55,47.31 0 top
R77  2.99,3.61 270 top
RESET  39.71,68.4 0 top
RJ1  22.03,66.48 90 top
U$1  2.66,12.79 0 top
X1  33.13,5.77 90 top

### Tracks (layer width: path | path; a pad name or v marks a point on that pad's centre or on a via)
3.3V  (via drill 0.6, 0.6 pad 0.3)
  Top 0.254: 6.5,16.52 7.52,17.54 7.52,21.15 7.65,21.29 R6.2
  Top 0.272: IC8.9 21.37,41.51 22.2,40.69 22.61,40.69 C51.1 22.78,40.52 v23.65,40.52 | IC7.5 29.61,34.95 R5.1 | U$1.N2 5.22,12.77 6.17,12.77 6.5,13.1 6.5,16.52 | R17.2 7.7,23.72 7.7,21.96 R6.2 7.59,21.8 | v11.94,18.62 12.58,18.62 Q1.E 13.48,19.52 R2.2 | R15.2 8.71,60.92 v8.71,59.32 | v42.08,63.13 41.95,63.26 R14.2
  Top 0.279: v39.57,3.1 39.97,3.5 39.97,10.64 39.21,11.41 35.47,11.41 arc-56 34.66,11.84 v34.16,12.76
  Top 0.305: 29.72,38.02 29.76,37.95 | R77.2 3.03,2.8 v4.71,2.8
  Top 0.406: 29.72,38.02 IC7.5 | MICROSD.4 12.2,4.63 12.2,3.04 v12.42,2.98 | v16.67,11.86 16.67,16.89 v16.62,17.07 | FB1.1 31.47,47.27 31.47,47.18 | 4.37,4.35 4.31,4.29 | C44.1 30.87,38.9 v31.55,39.58
  Top 0.61: JTAG.1 36.83,53.04 v37.49,52.37 | U$1.N2 5.2,12.69 4.31,11.8 4.31,4.29 4.31,3.2 v4.71,2.8 | 29.72,38.02 30.04,38.04 C44.1 | 31.47,47.18 arc-45 v31.53,47.41
  Bottom 0.254: IC1.84 21.75,31.83 21.54,31.62 21.54,30.62 21.95,30.21 21.95,29.86 | 21.95,29.86 21.95,29.59 21.26,28.9 | 21.95,29.86 22.66,29.86 23.23,30.43 24.14,30.43 24.27,30.3 | IC1.71 16.88,29.17 17.1,28.94 17.14,28.9 | C11.2 28.96,39.14 28.1,39.14 27.75,38.79 IC1.96 27.75,32 | 35.81,22.59 36.31,22.59 39.32,25.6 39.32,26.66 39.4,26.75 44.9,26.75
  Bottom 0.267: 24.27,30.3 25.27,30.3
  Bottom 0.272: C14.2 12.76,30.74 14.33,29.17 IC1.71 | IC1.84 21.75,35.52 21.19,36.08 20.67,36.08 C12.2 | 21.26,28.9 17.14,28.9 | 27.75,32 26.65,30.91 25.88,30.91 25.27,30.3 | v11.94,18.62 12.87,19.54 C8.2 13.29,20.67 IC1.54 17.08,20.67 17.1,20.7 | C9.2 21.75,12.79 IC1.42 21.75,18.37 21.54,18.58 17.63,18.58 17.34,18.87 17.1,19.11 17.1,20.7 | 17.1,20.7 17.1,28.94 | IC1.28 28.75,15.95 | 28.75,15.95 28.75,15.2 29.17,14.78 29.17,14.74 | 29.17,14.74 29.17,12.11 C10.2 29.18,14.73 29.17,14.74 | IC1.19 32.46,22.17 32.88,22.59 35.81,22.59 | L1.2 37.32,27.27 38.71,27.27 39.32,26.66 | 28.75,15.95 28.84,16.04 29.89,16.04 30.41,16.56 31.58,16.56 32.01,16.12
  Bottom 0.279: 32.01,16.12 34.16,13.98 v34.16,12.76
  Bottom 0.406: 30.51,69.81 30.5,69.8 11.19,69.8 8.71,67.32 v8.71,59.32 | v18.16,41.72 18.16,41.66 | 18.16,40.4 | 18.16,40.4 18.16,41.66 | 18.16,41.66 22.51,41.66 v23.65,40.52 24.03,40.52 arc45 24.21,40.6 25.41,41.8 25.41,44.7 arc-45 25.48,44.87 25.96,45.35 26.65,45.35 arc45 27.34,45.67 29.07,47.41 v31.53,47.41 31.53,44.78 arc45 31.61,44.6 32.51,43.7 32.51,40.54 v31.55,39.58 | 18.16,40.4 18.61,40.4 | IC10.2 12.54,9.76 13.73,10.94 14.21,10.94 14.39,11.12 14.39,11.8 | 14.39,11.8 16.62,11.8 v16.67,11.86 | 14.39,11.8 R16.2 | IC10.4 12.16,2.7 12.16,3.03 v12.42,2.98 | R52.2 18.6,40.4 | 18.6,40.4 R53.2 | R53.2 18.61,40.4 | 18.61,40.4 18.6,40.4 | 32.44,53.53 32.41,53.5 | v16.62,17.07 16.62,18.15 17.34,18.87
  Bottom 0.61: v37.49,52.37 37.49,53.53 | 37.49,53.53 32.44,53.53 | 37.49,53.53 37.49,59.75 38.43,60.69 42.08,60.69 | 30.51,69.81 37.19,63.13 v42.08,63.13 42.08,60.69 | 42.08,60.69 43.58,60.69 44.9,59.37 44.9,26.75 44.9,7.89 39.52,2.51 | IC10.2 12.54,5.9 12.43,5.79 C1.1 6.1,5.79 C65.1 5.08,5.82 4.31,5.05 4.31,3.2 v4.71,2.8 | IC10.4 13.86,1 38.01,1 39.52,2.51 | v31.53,47.41 31.53,52.73 32.31,53.5 32.41,53.5 | v39.57,3.1 39.52,2.64 39.52,2.51
  Bottom 0.813: 12.43,5.79 12.43,3.3 v12.42,2.98
5VREG
  Top 0.61: U$1.N41 40.76,2.7 | D6.A 22.75,2.98 25.07,0.66 39.77,0.66 40.76,1.66 40.76,2.7 | R3.1 40.85,2.62 40.76,2.7
AGND  (via drill 0.6)
  Top 0.272: v38.3,26.1 38.3,27.59 40.02,29.31 41.97,29.31 43.23,30.57 U$1.N56
  Bottom 0.254: 29.82,25.38 29.82,24.57 30.22,24.17 | 29.23,25.97 28.43,26.77 28.43,31.23 28.97,31.77
  Bottom 0.272: IC1.11 30.57,26.17 30.38,26.36 30.38,31.31 29.92,31.77 28.97,31.77 | 29.23,25.97 29.82,25.38 | 30.22,24.17 IC1.15 32.62,24.17 33.55,23.24 36.1,23.24 36.43,23.57 36.43,24.25 C6.2 36.45,24.3 37.04,24.3 38.3,25.56 v38.3,26.1
AVCC
  Bottom 0.272: IC1.12 32.72,25.67 32.92,25.86 32.92,26.21 | 32.92,26.21 32.92,26.54 32.79,26.67 IC1.10 | L1.1 34.7,26.21 34.7,26.58 38.68,30.57 U$1.N55 | 32.92,26.21 34.29,26.21 L1.1 | C6.1 34.43,26.06 L1.1
D+
  Top 0.272: U$1.N46 42.04,16.61 36,16.61 34.06,14.66 | R8.1 30.27,12.19 31.61,12.19 33.16,10.63 33.16,9.06 X1.3
  Top 0.279: 34.06,14.66 33.93,14.53 32.86,14.53 31.61,13.28 31.61,12.19
D-
  Top 0.272: X1.2 32.33,10.58 31.86,11.04 29.94,11.04 29.49,11.5 29.49,13.39 30.2,14.11 R9.1 | 30.15,14.21 R9.1 | 30.27,14.17 R9.1 | 33.86,15.25 35.85,17.24 40.14,17.24 U$1.N45
  Top 0.279: 33.86,15.25 33.72,15.12 32.58,15.12 31.52,14.05 R9.1
DIR1  (via drill 0.6)
  Top 0.272: U$1.N32 6.26,50.89 9.43,47.71 9.43,33.03 10.39,32.07 19.26,32.07 20.04,31.3 20.52,31.3 v20.56,31.27
  Bottom 0.272: IC1.80 19.75,31.59 20.07,31.27 v20.56,31.27
DIR2
  Bottom 0.254: IC1.49 18.25,16.24
  Bottom 0.272: 18.25,16.24 17.4,15.39 9.24,15.39 6.76,17.87 U$1.N6
DIR3
  Bottom 0.272: IC1.58 9.51,22.67 7.56,24.62 7.56,25.23 6.04,26.75 3.94,26.75 U$1.N13
DIR4
  Bottom 0.272: IC1.56 8.96,21.67 6.43,24.2 3.98,24.2 2.69,25.49 U$1.N11
DIR5
  Bottom 0.254: IC1.50 17.75,16.52
  Bottom 0.272: 17.75,16.52 17.17,15.93 9.61,15.93 6.42,19.12 3.74,19.12 2.66,20.2 U$1.N7
EN1  (via drill 0.6)
  Top 0.272: v17.38,34.41 17.07,34.41 15.87,33.21 11.03,33.21 10.53,33.71 10.53,49.75 8.11,52.17 3.65,52.17 2.66,53.16 U$1.N33
  Bottom 0.272: IC1.81 20.25,33.94 20.11,34.08 17.7,34.08 v17.38,34.41
EN2
  Bottom 0.272: IC1.48 18.75,15.97 17.62,14.84 8.87,14.84 7.12,16.59 3.93,16.59 U$1.N5
EN3
  Bottom 0.272: IC1.59 9.78,23.17 8.1,24.85 8.1,26.1 6.19,28.02 5.21,28.02 U$1.N14
EN4
  Bottom 0.272: IC1.57 9.23,22.17 5.91,25.49 U$1.N12
EN5  (via drill 0.6)
  Top 0.254: 20.66,32.62 21.36,32.62 22.44,31.54 v22.44,31.15
  Top 0.272: 20.66,32.62 10.61,32.62 9.98,33.26 9.98,47.98 7.81,50.15 v7.81,50.8
  Bottom 0.254: IC1.85 22.25,31.34 v22.44,31.15
  Bottom 0.272: 5.75,54.71 3.92,54.71 U$1.N35
  Bottom 0.279: 5.75,54.71 6.75,53.71 6.75,51.86 v7.81,50.8
ENET_CRS  (via drill 0.6)
  Top 0.272: IC8.11 22.37,42.34 22.64,42.07 24.31,42.07 25.26,41.11 v25.26,39.2
  Bottom 0.272: IC1.92 25.75,38.71 v25.26,39.2
ENET_MDC  (via drill 0.6)
  Top 0.272: IC8.13 24.37,43.59 26.82,41.14 26.82,37.61 24.14,34.93 v23.34,34.93 v23.33,34.93
  Bottom 0.272: IC1.87 23.25,34.85 v23.33,34.93
ENET_MDIO  (via drill 0.6)
  Top 0.272: IC8.12 24.42,42.84 26.25,41.02 26.25,37.96 24.24,35.95 22.78,35.95 v22.2,36.52
  Bottom 0.272: R52.1 18.55,37.23 21.5,37.23 v22.2,36.52 22.32,36.41 22.32,34.26 22.75,33.83 IC1.86
ENET_REF_CLK  (via drill 0.6)
  Top 0.254: R51.2 26,32.53 24.8,31.33 v24.72,31.33
  Bottom 0.254: IC1.88 23.75,31.59 24.01,31.33 v24.72,31.33
ENET_RX_ER  (via drill 0.6)
  Top 0.272: IC8.10 21.87,41.89 22.18,41.57 24,41.57 24.62,40.95 24.62,40.08 24.19,39.64 24.19,37.37 23.82,37 v23.82,36.93
  Bottom 0.272: IC1.89 24.25,36.49 v23.82,36.93 22.94,37.8 20.01,37.8 R53.1
ENET_RXD0  (via drill 0.6)
  Top 0.272: IC8.8 20.87,40.63 v21.11,40.38
  Bottom 0.272: IC1.91 25.25,37.86 23.63,39.48 22.02,39.48 v21.11,40.38
ENET_RXD1  (via drill 0.6)
  Top 0.272: IC8.7 20.37,41.34 20.13,41.09 20.13,39.35 v20.66,38.82
  Bottom 0.272: IC1.90 24.75,37.44 23.62,38.58 20.9,38.58 v20.66,38.82
ENET_TX_EN  (via drill 0.6)
  Top 0.272: IC8.16 25.59,45.09 v26.52,44.16
  Bottom 0.272: IC1.93 26.25,43.89 v26.52,44.16
ENET_TXD0  (via drill 0.6)
  Top 0.272: IC8.17 26.54,45.59 27.43,44.7 27.43,44.41 27.89,43.95 29.26,43.95 v29.44,44.13
  Bottom 0.272: IC1.95 27.25,42.3 28.9,43.95 29.26,43.95 v29.44,44.13
ENET_TXD1  (via drill 0.6)
  Top 0.272: IC8.18 27.3,46.09 v28.32,45.07
  Bottom 0.272: IC1.94 26.75,42.91 28.31,44.46 28.31,45.05 v28.32,45.07
GND  (via drill 0.6, 0.6 pad 0.3, 1.6)
  Top 0.254: 28.91,21.89 28.77,21.75 C15.2 | R63.1 16.7,47.83 16.05,48.48
  Top 0.267: 30.98,28.24 13.24,28.24 13.24,27 LED4.C
  Top 0.272: C56.2 15.18,55.19 RJ1.GND | 28.91,21.89 31.96,24.94 31.96,27.3 31.86,27.4 C17.2 30.98,28.24 30.98,28.26
  Top 0.279: 16.05,48.48 15.99,48.54 15.99,48.74 15.38,49.35 15.38,50.67 14.27,51.79 v14.27,52.18
  Top 0.406: IC8.THERM 20.93,45.53 20.91,45.53
  Bottom 0.254: 26.49,11.87 26.49,11.29 26.95,10.82 | 31.24,41.55 31.28,41.51 | IC1.97 28.25,35.38 28.77,35.9 28.77,37.43 C11.1
  Bottom 0.272: IC1.72 14.6,29.67 13.68,30.59 13.68,33.93 13.6,34.01 12.77,34.01 C14.1 | IC1.55 11.16,21.17 C8.1 | IC1.83 21.25,34.52 20.53,35.24 18.93,35.24 C12.1 18.49,36.12 17.13,37.47 15.91,37.47 | IC1.41 22.25,14.04 23.23,13.06 23.23,10.55 23.15,10.47 22.37,10.47 C9.1 | IC1.31 27.25,15.3 26.49,14.54 26.49,11.87 | 26.95,10.82 27.49,10.28 C10.1
  other vias: 17.87,50.1 25.35,50.11 28.76,52.61 12.08,35.09 31.27,15.43 31.25,41.51 23.95,6.96 10.56,18.89 33.1,2.76 15.21,39.8 21.56,44.84 8.53,10.18 32.66,12.74 5.74,8.87 36.08,15.14 32.29,37.74 30.24,45.58
  pour Bottom (isolate 0.305): 0.35,-0.5 0.4,74.74 48.1,74.74 48.05,-0.5
  pour Top (isolate 0.305): -0.26,-1.16 -0.11,74.74 46.63,74.87 46.48,-1.03
ISP_BOOT
  Top 0.272: U$1.N10 3.92,24.23 1.81,24.23 1.32,24.72 1.32,62.26 2.45,63.4 JP1.1
  Bottom 0.272: IC1.53 14.84,20.17 | 12.28,17.61 10.4,17.61 7.31,20.69 7.31,21.41 5.92,22.8 5.7,22.8 5.56,22.95 U$1.N10 5.06,22.95
  Bottom 0.279: 14.84,20.17 14.57,20.17 14.24,19.84 14.24,19.05 12.8,17.61 12.28,17.61
JTAG-RTCK
  Bottom 0.254: 31.24,32.92 31,32.93
  Bottom 0.272: IC1.100 29.76,32.93 31,32.93
  Bottom 0.813: 31,32.93 31.74,32.93
JTAG-TCK  (via drill 0.6)
  Top 0.272: v35.53,51.12 34.99,51.67 34.99,54.21 34.53,54.67 JTAG.4
  Bottom 0.272: IC1.5 32.62,29.17 34.81,31.35 34.81,33.51 36.71,35.42 36.71,45.28 37.11,45.68 37.11,47.09 38.44,48.42 38.44,49.87 38.41,49.9 38.41,49.91 37.73,50.59 36.06,50.59 v35.53,51.12
JTAG-TDI  (via drill 0.6)
  Top 0.272: v36.13,48.43 35.72,48.43 34.11,50.03 33.23,50.03 30.85,52.42 30.85,56.27 31.76,57.18 33.1,57.18 JTAG.8
  Bottom 0.272: IC1.2 32.38,30.67 33.61,31.9 33.61,34.02 35.43,35.84 35.43,45.78 35.93,46.27 35.93,48.22 v36.13,48.43
JTAG-TDO  (via drill 0.6)
  Top 0.272: JTAG.6 31.8,55.94 31.38,55.52 31.38,52.92 32.34,51.95 32.9,51.95 v33.35,51.5
  Bottom 0.254: IC1.1 31.82,31.17 arc90 32.01,31.36
  Bottom 0.272: 32.01,31.36 32.73,32.07 32.73,34.08 34.8,36.15 34.8,46.26 35.21,46.68 35.21,47.89 34.71,48.4 34.71,50.04 33.35,51.41 v33.35,51.5
JTAG-TMS  (via drill 0.6)
  Top 0.272: v37.31,49.48 35.63,49.48 34.33,50.78 34.33,53.36 34.29,53.4 JTAG.2
  Bottom 0.272: IC1.3 32.77,30.17 34.22,31.62 34.22,33.79 36.08,35.64 36.08,45.5 36.52,45.94 36.52,47.41 37.31,48.2 v37.31,49.48
LED1  (via drill 0.6)
  Top 0.267: 19.7,21.58 19.7,23.11 v19.95,23.37 20.33,23.74 20.56,23.74 21.46,24.65 21.5,24.65
  Top 0.272: R10.2 25.84,25.74 24.75,24.65 21.5,24.65 | 19.7,21.58 20.63,20.64 20.63,20.31 22.92,18.03 28.22,18.03 28.95,18.77 30.06,18.77 31.28,19.98 33.98,19.98 35.01,21.01 35.01,30.26 38.4,33.65 38.4,35.97 39.37,36.94 42.01,36.94 U$1.N60
  Bottom 0.267: 19.7,21.57 19.7,23.11 v19.95,23.37
  Bottom 0.272: IC1.32 26.75,19.15 25.64,20.26 23.26,20.26 22.55,20.98 20.29,20.98 19.7,21.57
LED1/REGOFF  (via drill 0.6)
  Top 0.272: IC8.3 17.33,45.09 v15.78,43.54 | v12.77,52.98 12.77,53.24 12.72,53.29 12.72,54.35 R61.2
  Bottom 0.272: 11.25,51.01 9.79,52.47 9.79,53.6 10.36,54.17 11.84,54.17 12.77,53.24 v12.77,52.98
  Bottom 0.279: v15.78,43.54 15.3,43.54 14.67,44.17 14.67,44.88 11.25,48.31 11.25,51.01
LED2  (via drill 0.6)
  Top 0.267: 19.95,19.73 19.95,20.43 19.06,21.32 19.06,22.6 18.53,23.13 v18.53,23.79 19.16,24.42 20.43,24.42
  Top 0.272: 20.43,24.42 20.81,24.8 20.81,25.31 21.1,25.6 22.26,25.6 R11.2 | 19.95,19.73 22.15,17.53 28.53,17.53 29.18,18.18 30.26,18.18 31.57,19.49 31.57,19.5 34.34,19.5 35.67,20.84 35.67,30.04 38.96,33.33 38.96,34.35 40.26,35.65 U$1.N59
  Bottom 0.267: 19.15,21.15 19.06,21.24 19.06,22.6 18.53,23.13 v18.53,23.79
  Bottom 0.272: IC1.33 26.25,18.84 25.45,19.64 23.01,19.64 22.34,20.31 19.99,20.31 19.15,21.15
LED2/NINTSEL  (via drill 0.6)
  Top 0.272: IC8.2 16.1,45.59 v15.64,45.13 | R62.2 9.46,56.12 9.67,55.9 9.67,54.6 9.89,54.39 10.67,54.39 R50.2 10.72,53.02 v10.9,52.85
  Bottom 0.272: 12.28,51.71 11.14,52.85 v10.9,52.85
  Bottom 0.279: v15.64,45.13 15.28,45.49 14.85,45.49 12.28,48.06 12.28,51.71
LED3  (via drill 0.6)
  Top 0.267: 21.8,16.97 19.14,19.64 19.14,20.24 18.07,21.3 v18.07,21.86 18.07,22.11 17.49,22.7 17.49,24.94 R12.2
  Top 0.272: U$1.N58 43.21,33.11 41.96,34.36 39.89,34.36 39.52,33.99 39.52,33.02 36.27,29.76 36.27,20.54 36.12,20.39 36.12,20.38 34.64,18.9 31.87,18.9 30.57,17.59 29.41,17.59 28.79,16.97 21.8,16.97
  Bottom 0.267: 22.06,19.71 19.67,19.71 18.04,21.33 18.04,21.83 v18.07,21.86
  Bottom 0.272: IC1.34 25.75,18.56 25.24,19.07 22.69,19.07 22.06,19.71
LED4  (via drill 0.6)
  Top 0.272: 17.89,19.65 18.19,19.65 21.41,16.44 29.14,16.44 29.77,17.06 30.94,17.06 32.17,18.3 35.08,18.3 37.08,20.3 37.08,29.43 U$1.N57 | R13.2 13.47,25.17 13.47,24.66 13.69,24.44 16.42,24.45 16.86,24.01 16.86,20.66 17.74,19.78 17.89,19.65 | v18.03,19.83 17.89,19.65
  Bottom 0.272: IC1.35 25.25,18.31 25.05,18.51 22.39,18.51 21.78,19.12 18.35,19.12 18.07,19.4 18.13,19.46 v18.03,19.83
MISO1
  Bottom 0.272: IC1.61 10.31,24.17 9.19,25.29 9.19,27.37 6,30.57 U$1.N16
MOSI1
  Bottom 0.272: IC1.60 10.05,23.67 8.65,25.07 8.65,27.14 6.49,29.29 3.89,29.29 2.66,30.52 U$1.N15
N$1
  Bottom 0.272: IC1.22 32.72,20.67 Q2.2 33.51,21.46 C2.1
N$2
  Bottom 0.272: IC1.23 32.86,20.17 33.39,19.64 33.39,16.51 Q2.1 C3.1
N$3
  Top 0.272: Q1.B 15.32,21.17 R2.1 15.17,21.32 R1.1
N$4  (via drill 0.6)
  Top 0.61: 22.75,8.82 D6.C | D6.C 20.48,9 19.57,8.09 v19.57,6.5 | D1.C 22.5,9 D6.C
  Bottom 0.272: IC10.3 14.85,8.07 15.11,7.81
  Bottom 0.61: 17.9,7.8 C64.A | C64.A 15.11,7.81 14.92,8 | C64.A 18.77,7.81 19.57,7.01 v19.57,6.5
N$5
  Top 0.272: R50.1 10.72,66.74 RJ1.Y+
N$6
  Top 0.272: R61.1 12.78,57.52 11.33,58.97 11.33,66.43 14.95,70.05 27.24,70.05 RJ1.G+
N$7  (via drill 0.6)
  Top 0.272: v27.84,24.42 30.07,24.42 30.97,25.32 30.97,25.7 31,25.72
N$8
  Top 0.272: R51.1 25.99,34.58 26.21,34.81 R5.2 | R5.2 | R5.2 27.75,37.94 IC7.4
N$10
  Top 0.406: 5V.A R3.2
N$11
  Top 0.267: 29.63,40.69 29.63,42.08
N$13
  Top 0.406: 5.71,64.2 5.71,65
N$14
  Bottom 0.272: 30.83,22.66 29.38,22.66 27.81,24.23 27.81,24.39
N$15
  Bottom 0.254: 30,23.66 29.25,24.42 29.25,25.22
  Bottom 0.272: 30.91,23.66 30,23.66 | 29.25,25.22 28.47,25.99 26.58,25.99 25.91,25.32 25.91,24.56 25.98,24.48
N$16  (via drill 0.6)
  Top 0.254: 22.29,50 C52.1 | 20.89,51.98 R57.1 20.85,52.02
  Top 0.272: 25.13,46.85 v25.57,47.29 | C13.1 14.16,48.26 C46.1 | IC8.19 23.04,46.84 23.05,46.85
  Top 0.279: IC8.1 16,46.09 15.79,46.31 15.43,46.31 15.03,46.71 15.03,48.22 v15.01,48.24 14.99,48.26 14.16,48.26
  Top 0.406: C47.1 FB1.2 28.03,47.3 25.61,47.3 25.16,46.85 25.13,46.85 23.05,46.85 22.99,46.85 | RJ1.P5 21.39,58.86 RJ1.P4 21.64,56.58 v21.64,53.78 | R56.1 20.16,54.29 21.59,54.29 | 21.59,54.29 R55.1 | v21.64,53.78 21.59,53.84 21.59,54.29 | v21.64,53.78 21.56,53.7 21.56,51.99 | 21.56,51.99 21.56,50.01 | 21.56,50.01 21.55,50 C53.1 | 21.56,50.01 21.6,49.97 C52.1 | R57.1 20.88,51.99 21.56,51.99 | R54.1 22.3,51.99 21.56,51.99
  Bottom 0.279: 15.26,49.79 15.01,49.54 v15.01,48.24
  Bottom 0.406: v25.57,47.29 26.55,48.26 26.55,51.57 24.34,53.78 v21.64,53.78 19.25,53.78 15.26,49.79
N$17  (via drill 0.6)
  Top 0.272: v26.03,24.51 25.44,23.92 24.52,23.92 23.94,23.34 23.94,21.71
N$18
  Top 0.254: 27.8,37.97 28.61,37.97
N$19
  Bottom 0.254: 28.85,39.27 29.61,39.27 30.12,39.78 31.64,39.78
N$51
  Top 0.272: R7.2 21.53,14.25 17.55,18.23 16.06,18.23 15.16,17.33 14.44,17.33 Q1.C
N$67
  Top 0.272: IC8.4 18.33,44.59 16.08,42.34 14.48,42.34 13.55,43.26 Q3.1
  Bottom 0.272: C59.1 11.62,44.27 Q3.1
N$68
  Top 0.272: IC8.5 18.67,44.09 15.96,41.38 14.68,41.38 13.55,40.26 Q3.2
  Bottom 0.272: C58.1 11.67,39.45 Q3.2
N$69
  Top 0.272: IC8.24 20.37,47.11 20.17,47.31
  Top 0.61: R63.2 20.17,47.31
N$77
  Top 0.272: IC8.14 24.58,44.09 26.57,42.1 R4.1 28.7,41.36 28.7,40.64 28.66,40.6 IC7.2
N$80
  Top 0.406: R77.1 3.3V.A
N$82
  Top 0.272: C7.1 19.2,40.16 19.2,41.78 19.66,42.24 19.66,43.55 IC8.6
  Top 0.406: 19.28,40 C7.1 C49.1
N$84
  Top 0.267: LED4.A 15.19,26.48 R13.1
N$85
  Top 0.267: LED3.A 19.69,26.8 R12.1
N$86
  Top 0.272: R11.1 24.78,26.41 24.78,27.12 LED2.A
N$87
  Top 0.267: R10.1 29.56,25.82 LED1.A
P1_22  (via drill 0.6)
  Top 0.272: 39.27,14.07 42.01,14.07 43.27,15.33 U$1.N44
  Top 0.279: 39.27,14.07 37.96,14.07 36.31,12.42 v35.52,12.42 v35.51,12.42
  Bottom 0.272: IC1.36 24.75,15.41 25.97,14.19 25.97,9.57 26.94,8.6 34.92,8.6
  Bottom 0.279: 34.92,8.6 35.51,9.2 v35.51,12.42
P1_23  (via drill 0.6)
  Top 0.272: U$1.N43 39.47,15.33
  Top 0.279: 39.47,15.33 37.82,15.33 v36.17,13.68
  Bottom 0.254: 36.54,10.91 36.54,13.16
  Bottom 0.272: IC1.37 24.25,15.13 25.42,13.96 25.42,9.33 26.75,8 35.79,8 36.7,8.91 36.7,10.74 36.54,10.91
  Bottom 0.279: 36.54,13.16 36.54,13.31 v36.17,13.68
P1_30  (via drill 0.6)
  Top 0.254: 25.43,28.8 24.94,29.28 v23.67,29.28
  Top 0.272: 25.43,28.8 30.77,28.8 31.94,29.97 31.94,31.69 35.34,35.1 35.34,41.22 37.39,43.27 U$1.N65
  Bottom 0.254: 24.93,28.99 24.64,29.28 v23.67,29.28
  Bottom 0.272: IC1.21 29.21,21.17 27.94,22.44 24.94,22.44 23.76,23.62 23.76,25.93 24.93,27.1 24.93,28.99
P1_31  (via drill 0.6)
  Top 0.254: 26.76,29.38 26.52,29.38 v26.18,29.73
  Top 0.272: 26.76,29.38 30.49,29.38 31.3,30.2 31.3,32 34.73,35.43 34.73,41.55 37.69,44.51 42.06,44.51 U$1.N66
  Bottom 0.254: 26.34,27.63 26.34,29.57 v26.18,29.73
  Bottom 0.272: IC1.20 29.58,21.67 28.28,22.97 25.31,22.97 24.46,23.82 24.46,25.75 26.34,27.63
P2.6
  Bottom 0.272: IC1.67 13.26,27.17 8.57,31.86 8.57,34.76 6.43,36.91 3.94,36.91 U$1.N21
P2.7
  Bottom 0.272: IC1.66 12.99,26.67 8.02,31.64 8.02,34.08 6.44,35.66 5.21,35.66 U$1.N20
P2.9  (via drill 0.6)
  Top 0.272: v11.29,26.24 11.83,26.24 12.41,25.67 12.41,23.21 12.84,22.78 13.45,22.78 R1.2 | 13.54,23.19 R1.2 | R1.2 13.48,22.81 13.48,23.63 13.65,23.79 16,23.79 16.24,23.55 16.24,20.11 17.51,18.84 18.07,18.84 21.02,15.9 29.94,15.9 30.53,16.48 31.23,16.48 32.45,17.7 35.49,17.7 37.44,19.64 | 39.34,25.47 39.34,26.61 U$1.N53
  Top 0.279: 37.44,19.64 39.34,21.55 39.34,25.47
  Bottom 0.272: IC1.64 11.87,25.67 v11.29,26.24
PLAY
  Bottom 0.272: IC1.51 15.47,19.17 | 12.81,16.5 9.81,16.5 5.91,20.41 U$1.N8
  Bottom 0.279: 15.47,19.17 15.47,18.35 13.62,16.5 12.81,16.5
PLAY_LED  (via drill 0.6)
  Top 0.272: v17.08,35.88 16.37,35.17 16.37,34.56 15.59,33.79 11.63,33.79 11.1,34.32 11.1,50.05 7.72,53.43 U$1.N34
  Bottom 0.272: IC1.82 20.75,34.23 20.34,34.64 18.54,34.64 17.62,35.55 17.4,35.55 v17.08,35.88
POT_SCL
  Bottom 0.272: IC1.47 19.25,15.69 17.84,14.28 8.53,14.28 7.49,15.33 U$1.N4
POT_SDA
  Bottom 0.272: IC1.46 19.75,15.42 18.07,13.74 8.16,13.74 7.85,14.05 3.93,14.05 U$1.N3
PWM0
  Bottom 0.272: IC1.69 13.8,28.17 9.65,32.32 9.65,35.52 5.72,39.45 3.94,39.45 U$1.N23
PWM1
  Bottom 0.272: IC1.68 13.53,27.67 9.11,32.09 9.11,35.26 6.18,38.19 U$1.N22
RD+
  Top 0.267: R56.2 18.36,54.29 18.36,56.35
  Top 0.272: IC8.23 20.87,47.77 20.22,48.42 17.37,48.42 16.37,49.42 16.37,50.77 16.86,51.27 16.86,54.22 C56.1 R56.2 | 18.36,56.35 18.87,56.87 18.87,58.2 20.13,59.46 20.13,60.94 20.72,61.54 22.07,61.54 23.43,60.18 RJ1.RD+
RD-
  Top 0.272: IC8.22 21.37,48.08 20.46,48.99 17.6,48.99 16.94,49.65 16.94,50.57 17.74,51.37 17.74,51.98 C57.1 R57.2 | R57.2 19.21,52.05 19.21,56.16 20.11,57.06 RJ1.RD- | 19.15,51.98 R57.2
RESET  (via drill 0.6)
  Top 0.254: 30.08,29.99 30.02,29.93 27.91,29.93 v27.49,30.35
  Top 0.272: 30.08,29.99 30.64,30.55 30.64,32.28 34.07,35.71 34.07,43.2 33.11,44.16 | JTAG.10 31.87,58.48 30.2,56.81 30.2,52.11 33.11,49.2 | 33.26,63.26 R14.1 | 36.71,47.39 36.89,47.56 39.23,49.91 39.23,51.3 40.12,52.19 42.12,52.19 43.3,53.37 U$1.N74
  Top 0.279: 33.11,44.16 32.66,44.61 32.66,45.84 33.15,46.33 35.65,46.33 36.2,46.87 | 36.2,46.87 36.89,47.56 | 33.11,49.2 33.87,49.2 36.2,46.87
  Top 0.305: RESET.2 RESET.1 34.61,70.3 33.21,68.9 33.21,63.1 | 33.21,63.1 33.21,58.56 JTAG.10 | 33.26,63.26 33.26,63.15 33.21,63.1
  Bottom 0.254: 29.68,23.17 28.73,24.11 28.73,24.86 28.2,25.39 | 26.95,25.11 26.95,23.9 | 25.05,25.42 27.49,27.85 v27.49,30.35
  Bottom 0.272: IC1.17 29.68,23.17 | 28.2,25.39 27.24,25.39 26.95,25.11 | 26.95,23.9 26.58,23.53 25.64,23.53 25.05,24.11 25.05,25.42
RSTOUT  (via drill 0.6)
  Top 0.254: 29.49,32.02 29.38,31.91 v29.38,30.85
  Top 0.267: 29.91,43.17 32.26,43.17 33.44,41.99
  Top 0.272: 29.91,43.17 26.21,43.17 24.79,44.59 IC8.15 | 29.49,32.02 33.44,35.96 33.44,41.99
  Bottom 0.254: 29.87,30.52 29.53,30.85 v29.38,30.85
  Bottom 0.272: IC1.14 30.6,24.67 30.35,24.91 30.35,25.7 29.87,26.18 29.87,30.52
RX_0  (via drill 0.6)
  Top 0.272: 37.09,46.76 39.99,49.65 42.02,49.65 43.26,50.89 U$1.N72
  Top 0.279: 37.09,46.76 35.44,45.1 v33.73,45.1
  Bottom 0.272: IC1.99 29.25,34.65 29.73,35.12 32.86,35.12 34.1,36.35
  Bottom 0.279: 34.1,36.35 34.1,44.73 v33.73,45.1
SCK1
  Bottom 0.272: IC1.62 10.59,24.67 9.75,25.51 9.75,27.6 6.41,30.94 6.41,31.67 6.25,31.83 3.94,31.83 U$1.N17
SCL  (via drill 0.6)
  Top 0.267: 21.59,21.75 21.59,23.09 v21.45,23.23
  Top 0.272: U$1.N63 37.24,40.73 36.59,40.08 36.59,34.54 33.11,31.06 33.11,24.51 29.14,20.54 27.07,20.54 25.87,19.35 23.53,19.35 21.94,20.94 21.94,21.39 21.59,21.75
  Bottom 0.267: 22.87,23.72 21.93,23.72 v21.45,23.23
  Bottom 0.272: IC1.24 30.63,19.67 29.65,20.64 28.94,20.64 28.48,21.1 27.43,21.1 26.59,21.94 24.65,21.94 22.87,23.72
SD_CD
  Top 0.272: JP1.3 2.29,65.02 0.67,63.41 0.67,23.92 1.6,22.99 2.61,22.99 U$1.N9
  Bottom 0.272: IC1.52 15.06,19.67 | 12.46,17.06 10.07,17.06 6.68,20.45 6.68,21.05 6.07,21.66 3.95,21.66 U$1.N9
  Bottom 0.279: 15.06,19.67 14.85,19.46 14.85,18.67 13.24,17.06 12.46,17.06
SD_CS  (via drill 0.6)
  Top 0.272: U$1.N31 3.92,49.63 6.35,49.63 8.87,47.1 8.87,32.79 10.14,31.52 18.92,31.52 20.54,29.9 v20.83,29.9 | MICROSD.2 14.35,8.34
  Top 0.279: 14.35,8.34 11.21,11.48 v11.21,11.86
  Bottom 0.272: IC1.79 19.25,31.18 20.54,29.9 v20.83,29.9 | R16.1 11.26,11.81 v11.21,11.86
  Bottom 0.279: v11.21,11.86 10.89,11.53 7.84,11.53 6.9,10.59 2.48,10.59 1.16,11.91 1.16,49.39 U$1.N31
SD_IRQ  (via drill 0.6)
  Top 0.272: v27.69,18.97 28.18,19.45 29.78,19.45 34.33,24 34.33,30.45 37.81,33.93 37.81,37.59 38.41,38.19 U$1.N61
  Bottom 0.272: IC1.27 29.25,18.34 28.61,18.97 v27.69,18.97
SD_MISO  (via drill 0.6)
  Top 0.254: 6.5,26.78 8.54,24.74 8.54,22.84 R6.1 | 7.1,16.21 8.1,17.21 8.1,20.28
  Top 0.272: 7.77,32.33 7.77,45.55 6.25,47.07 3.93,47.07 | MICROSD.7 8.85,7.39 7.1,9.14 7.1,16.21 | U$1.N29 3.93,47.07 | 6.5,26.78 6.5,44.06 6.03,44.53 4.57,44.53 3.93,45.17 3.93,47.07 | 9.39,21.91 R6.1 9.24,21.76 9.24,21.42 8.1,20.28
  Top 0.279: 7.77,32.33 9.72,30.38 17.42,30.38 v17.79,30.01
  Bottom 0.272: IC1.77 18.25,30.48 v17.79,30.01
SD_MOSI
  Top 0.254: 7.15,26.93 9.44,24.64 R17.1 | 9.81,16.3 8.74,17.37 8.74,19.84
  Top 0.272: 7.15,26.93 7.15,44.69 6.03,45.81 U$1.N28 | MICROSD.3 13.25,8.14 9.81,11.58 9.81,16.3 | R17.1 10.24,23.74 10.34,23.63 10.34,20.85 10.15,20.66 9.56,20.66 8.74,19.84
  Bottom 0.272: IC1.76 16.66,32.92 16.01,33.56 16.01,35.55 13.83,37.74 11.33,37.74 8.56,40.51 8.56,43.28 6.03,45.8 U$1.N28
SD_SCK  (via drill 0.6)
  Top 0.272: v19.17,29.88 19.17,30.02 18.21,30.98 9.9,30.98 8.33,32.56 8.33,46.1 6.12,48.31 5.24,48.31 U$1.N30
  Top 0.279: MICROSD.5 11.05,2.71 11.83,1.93 14.62,1.93 16.4,3.71 16.4,8.28 10.63,14.05 10.63,16.33 9.36,17.6 9.36,19.56 9.87,20.07 10.43,20.07 10.91,20.55 10.91,24.18 7.81,27.28 7.81,27.89 9.67,29.74 16.53,29.74 17.36,28.91 18.43,28.91 19.17,29.65 v19.17,29.88
  Bottom 0.272: IC1.78 18.75,30.3 v19.17,29.88
SD_WP  (via drill 0.6)
  Top 0.267: v20.62,22.12 20.62,21.73 21.32,21.03 21.32,20.64
  Top 0.272: 21.32,20.64 23.23,18.74 26.1,18.74 27.36,20 29.53,20 33.67,24.13 33.67,30.7 37.2,34.23 37.2,38.48 38.18,39.46 42.03,39.46 U$1.N62
  Bottom 0.272: IC1.26 29.75,18.75 28.99,19.51 28.5,19.51 28.01,20 26.79,20 25.93,20.86 23.52,20.86 22.78,21.6 21.14,21.6 v20.62,22.12
SDA  (via drill 0.6)
  Top 0.267: 23.82,19.93 22.67,21.09 v22.67,22.56
  Top 0.272: 23.82,19.93 25.61,19.93 26.73,21.05 28.83,21.05 32.51,24.74 32.51,31.38 35.95,34.82 35.95,40.58 37.36,42 42.01,42 43.28,40.73 U$1.N64
  Bottom 0.272: IC1.25 30.1,19.17 29.17,20.1 28.69,20.1 28.28,20.51 27.21,20.51 26.29,21.43 23.77,21.43 22.72,22.49 v22.67,22.56
SSEL1
  Bottom 0.254: 5.3,33.11 U$1.N18
  Bottom 0.272: IC1.63 10.86,25.17 10.28,25.74 10.28,27.84 6.95,31.17 6.95,32.26 6.1,33.11 U$1.N18
STP1
  Bottom 0.272: U$1.N27 3.93,44.53 6.02,44.53 8.01,42.54 8.01,40.28 11.12,37.17 13.59,37.17 15.46,35.3 15.46,31.17 IC1.75
STP2
  Bottom 0.272: IC1.74 15.13,30.67 14.89,30.91 14.89,35.07 13.36,36.61 10.91,36.61 7.36,40.15 7.36,42.18 6.22,43.33 5.26,43.33 U$1.N26
STP3
  Bottom 0.272: IC1.73 14.87,30.17 14.26,30.91 14.26,34.93 13.13,36.06 10.68,36.06 6.66,40.08 6.66,41.07 5.74,41.99 3.93,41.99 U$1.N25
STP4
  Bottom 0.272: IC1.70 14.07,28.67 10.19,32.55 10.19,35.74 U$1.N24
STP5
  Bottom 0.272: IC1.65 12.72,26.17 7.48,31.41 7.48,33.16 6.25,34.39 3.92,34.39 U$1.N19
TD+
  Top 0.272: IC8.21 21.87,48.1 22.73,48.97 25.59,48.97 26.41,49.79 26.41,50.6 25.54,51.48 25.54,51.99 C54.1 R54.2 23.92,52.1 23.92,58.41 25.64,60.13 RJ1.TD+
TD-
  Top 0.272: IC8.20 22.37,47.83 22.96,48.42 25.83,48.42 26.97,49.56 26.97,50.8 26.36,51.41 26.36,54.27 C55.1 | C55.1 R55.2 | C55.1 26.38,56.41 RJ1.TD-
TH1
  Bottom 0.272: IC1.9 34.4,27.17 37.51,30.29 37.51,32.86 39.21,34.56 39.21,44.26 U$1.N67
TH2
  Bottom 0.272: IC1.8 33.96,27.67 36.85,30.56 36.85,33.02 38.58,34.74 38.58,44.56 38.97,44.95 38.97,46.06 39.98,47.06 42.05,47.06 U$1.N68
TH3
  Bottom 0.272: IC1.7 33.58,28.17 36.21,30.79 36.21,33.21 37.92,34.92 37.92,44.86 38.31,45.26 38.31,46.47 40.16,48.32 40.74,48.32 U$1.N69
TH4
  Bottom 0.272: IC1.6 33.19,28.67 35.57,31.05 35.57,33.37 37.34,35.14 37.34,45.09 37.64,45.4 37.64,46.64 39.32,48.32 39.32,49.23 39.72,49.64 42.01,49.64 arc-90 42.06,49.59 U$1.N70
TX_0
  Bottom 0.272: IC1.98 28.75,34.97 29.47,35.7 32.55,35.7 33.44,36.58 33.44,43.91 32.51,44.84 32.51,50.81 32.36,50.96 32.36,52.2 32.75,52.6 35.61,52.6 | 35.61,52.6 | U$1.N71 38.55,50.89 38.15,51.29 37.03,51.29 35.72,52.6 35.61,52.6
USB_D+  (via drill 0.6)
  Top 0.272: R7.1 22.45,13.17 24.69,13.17 25.03,12.82 C5.2 25.06,12.15 27.46,12.15 v27.47,12.22 R8.2
  Bottom 0.254: 28.46,13.21 v27.47,12.22
  Bottom 0.272: 28.46,13.21 28.46,13.4 28.46,14.6 28.25,14.81 IC1.29
USB_D-  (via drill 0.6)
  Top 0.254: R9.2 v27.45,14.05 v27.44,14.05 27.37,14.13 C4.2
  Bottom 0.254: IC1.30 27.75,14.36 v27.44,14.05
USR_SW
  Top 0.272: R15.1 8.69,63.57 8.05,64.21 7.21,64.21 | 7.21,64.21 JP1.2 | ISP.1 2.7,70.64 7.21,70.64 | 8.4,70.64 7.21,70.64 | 7.21,70.64 7.21,64.21
  Top 0.406: 8.4,70.64 ISP.2
VUSB
  Top 0.508: X1.1 31.53,7.27
  Top 0.61: 31.53,7.27 31.53,6.88 30.84,6.19 25.8,6.19 D1.A
X_MAX
  Bottom 0.272: IC1.39 23.25,14.6 24.32,13.53 24.32,8.9 26.35,6.87 36.45,6.87 37.91,8.33 37.91,11.12 37.68,11.35 37.68,21.77 40.14,24.23 41.44,24.23 42.7,25.49 U$1.N52
X_MIN
  Bottom 0.272: IC1.38 23.75,14.87 24.88,13.75 24.88,9.11 26.58,7.41 36.19,7.41 37.3,8.52 37.3,10.93 37.11,11.12 37.11,22.4 40.2,25.49 U$1.N51
Y_MAX
  Bottom 0.272: IC1.43 21.25,9.33 22.41,8.17 22.41,7.08 24.09,5.41 36.74,5.41 39.19,7.86 39.19,11.56 38.87,11.88 38.87,20.39 40.15,21.67 42.03,21.67 U$1.N50
Y_MIN
  Bottom 0.272: 38.31,21 38.31,11.56 38.53,11.35 38.53,8.16 36.57,6.2 26.19,6.2 23.82,8.57 23.82,13.24 22.75,14.31 IC1.40 | 38.31,21 | 38.31,21 40.24,22.93 40.24,22.98 40.28,22.95 U$1.N49
Z_MAX
  Bottom 0.272: IC1.45 20.25,8.71 21.33,7.63 21.33,6.59 23.61,4.31 37.51,4.31 40.45,7.25 40.45,10.54 42.02,12.11 42.02,19.13 U$1.N48
Z_MIN
  Bottom 0.272: IC1.44 20.75,9.05 21.88,7.92 21.88,6.83 23.85,4.86 37.21,4.86 39.82,7.48 39.82,11.88 39.52,12.19 39.52,19.17 U$1.N47
(copper drawn outside any net)
  shapes: Top area x1

### Text on the board
tNames: -USR
_tsilk: FN | 4 | 3 | 2 | 1 | AAKAR / CPU BOARD / LPC176x
_bsilk: VER 2.B | www.aakar3dp.in